# Altium project balenaFin_v1_x_x.PrjPcb (part 1 of 3)
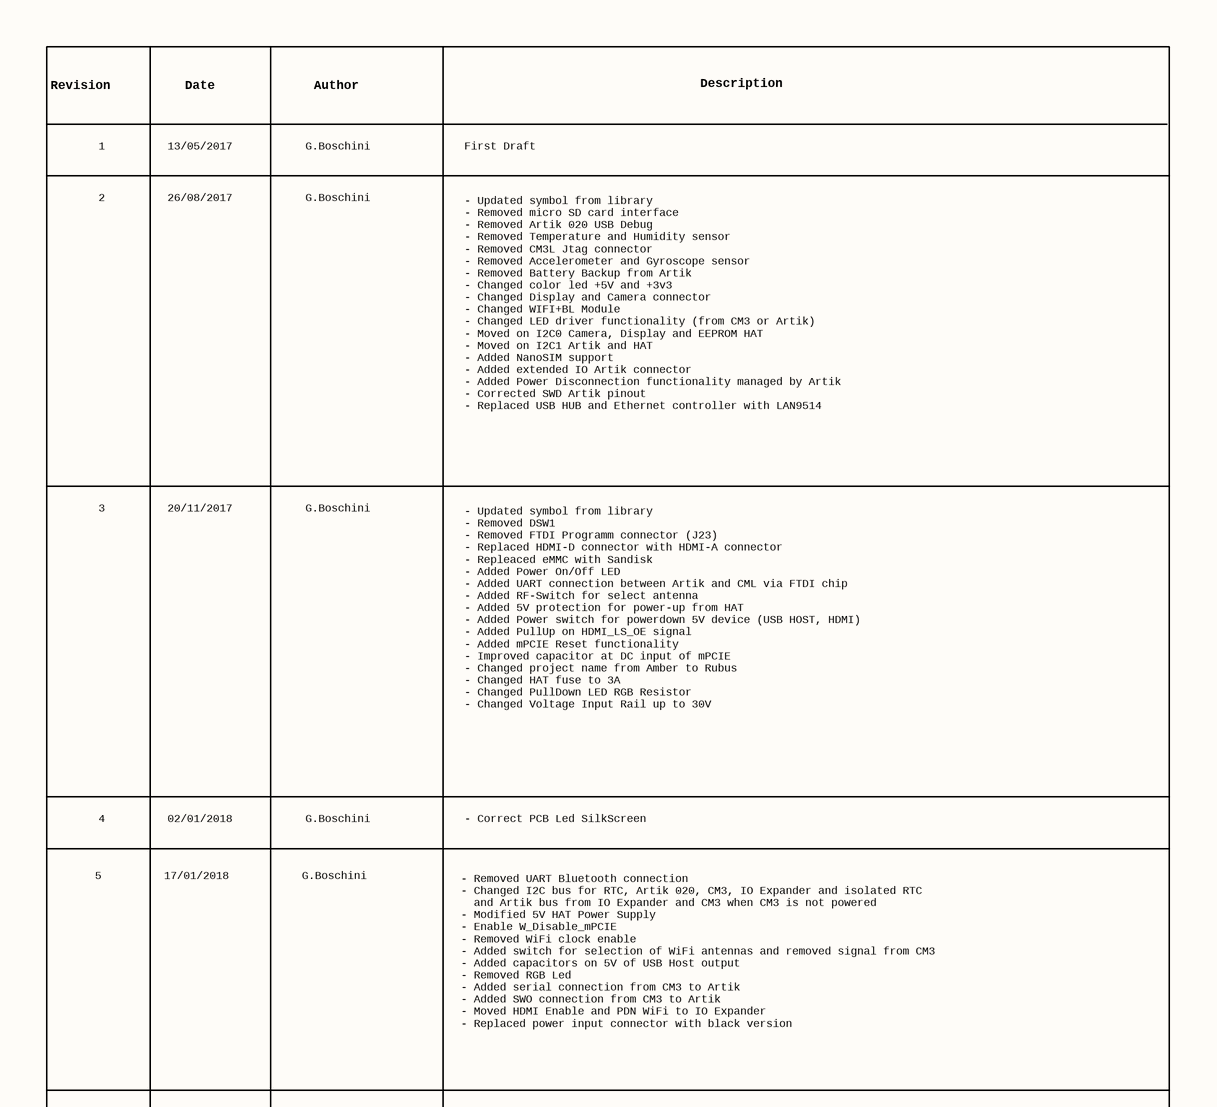
[diagram p0: 00 - REVISION.SchDoc, top left]
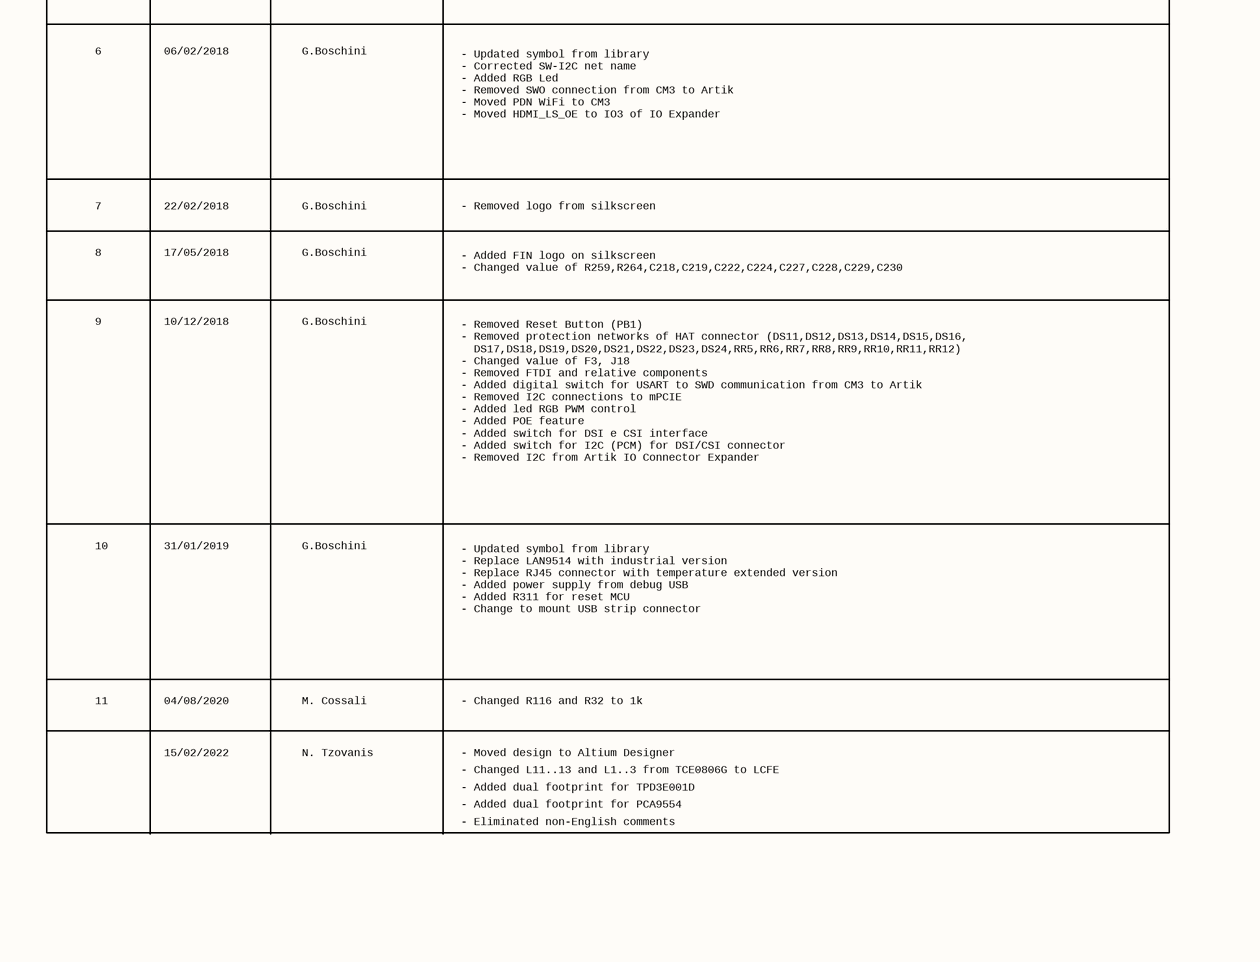
[diagram p1: 00 - REVISION.SchDoc, bottom left]
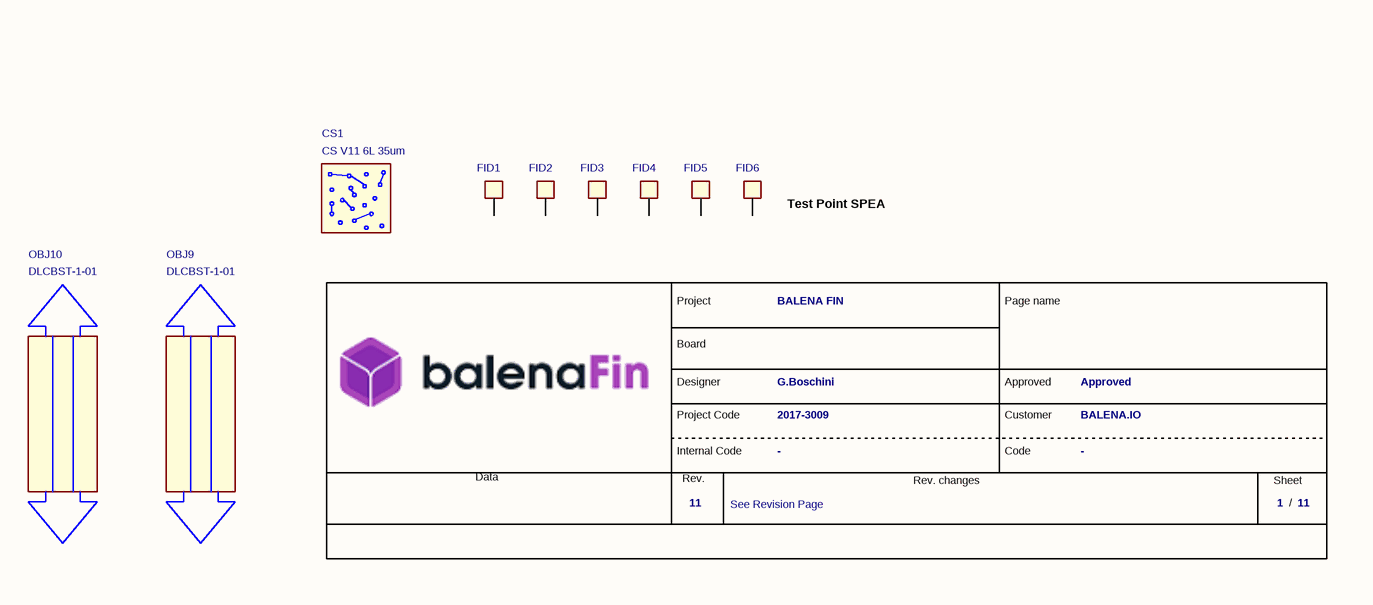
[diagram p2: 00 - REVISION.SchDoc, bottom right]
11 sheets, 518 parts. Net scope: global (net labels, ports and power ports of the same name join across sheets).
Board file: balenaFin_v1_x_x.PcbDoc
Sheets:
  00 - REVISION.SchDoc
  01 - CML3 CONNECTOR.SchDoc
  02 - POWER.SchDoc
  03 - WIFI - BLE.SchDoc
  04 - MIPI INTERFACE.SchDoc
  05 - USB.SchDoc
  06 - MCU.SchDoc
  07 - eMMC.SchDoc
  08 - HAT.SchDoc
  09 - mPCIE.SchDoc
  10 - ETHERNET.SchDoc

## Sheet 00 - REVISION.SchDoc
size 420 x 297 mm

### Parts
*?  Revision: 11  FAE RD code: 2017-3009  DocumentoRev: See Revision Page  Page Number: 1  Nome Progetto: BALENA FIN  Customer name: BALENA.IO  Project manager: Approved  Project designer: G.Boschini  (hidden comment: MyFAEVuoto)  (graphical)
CS1  CS V11 6L 35um  (graphical)
FID1  TPS  [FIDUCIAL]  (value not drawn)  (no BOM)
FID2  TPS  [FIDUCIAL]  (value not drawn)  (no BOM)
FID3  TPS  [FIDUCIAL]  (value not drawn)  (no BOM)
FID4  TPS  [FIDUCIAL]  (value not drawn)  (no BOM)
FID5  TPS  [FIDUCIAL]  (value not drawn)  (no BOM)
FID6  TPS  [FIDUCIAL]  (value not drawn)  (no BOM)
OBJ9  DLCBST-1-01  (mechanical)
OBJ10  DLCBST-1-01  (mechanical)

### Nets

Not connected (* = marked no-connect by the designer): FID1 1(TP); FID2 1(TP); FID3 1(TP); FID4 1(TP); FID5 1(TP); FID6 1(TP)

### Notes on the sheet
- Revision
- Date
- Author
- Description
- 1
- 2
- 13/05/2017
- 26/08/2017
- G.Boschini
- First Draft
- - Updated symbol from library
  - Removed micro SD card interface
  - Removed Artik 020 USB Debug
  - Removed Temperature and Humidity sensor
  - Removed CM3L Jtag connector
  - Removed Accelerometer and Gyroscope sensor
  - Removed Battery Backup from Artik
  - Changed color led +5V and +3v3
  - Changed Display and Camera connector
  - Changed WIFI+BL Module
  - Changed LED driver functionality (from CM3 or Artik)
  - Moved on I2C0 Camera, Display and EEPROM HAT
  - Moved on I2C1 Artik and HAT
  - Added NanoSIM support
  - Added extended IO Artik connector
  - Added Power Disconnection functionality managed by Artik
  - Corrected SWD Artik pinout
  - Replaced USB HUB and Ethernet controller with LAN9514
- 3
- 20/11/2017
- 4
- 02/01/2018
- - Updated symbol from library
  - Removed DSW1
  - Removed FTDI Programm connector (J23)
  - Replaced HDMI-D connector with HDMI-A connector
  - Repleaced eMMC with Sandisk
  - Added Power On/Off LED
  - Added UART connection between Artik and CML via FTDI chip
  - Added RF-Switch for select antenna
  - Added 5V protection for power-up from HAT
  - Added Power switch for powerdown 5V device (USB HOST, HDMI)
  - Added PullUp on HDMI_LS_OE signal
  - Added mPCIE Reset functionality
  - Improved capacitor at DC input of mPCIE
  - Changed project name from Amber to Rubus
  - Changed HAT fuse to 3A
  - Changed PullDown LED RGB Resistor
  - Changed Voltage Input Rail up to 30V
- - Correct PCB Led SilkScreen
- 5
- 17/01/2018
- - Removed UART Bluetooth connection
  - Changed I2C bus for RTC, Artik 020, CM3, IO Expander and isolated RTC
  and Artik bus from IO Expander and CM3 when CM3 is not powered
  - Modified 5V HAT Power Supply
  - Enable W_Disable_mPCIE
  - Removed WiFi clock enable
  - Added switch for selection of WiFi antennas and removed signal from CM3
  - Added capacitors on 5V of USB Host output
  - Removed RGB Led
  - Added serial connection from CM3 to Artik
  - Added SWO connection from CM3 to Artik
  - Moved HDMI Enable and PDN WiFi to IO Expander
  - Replaced power input connector with black version
- 6
- 06/02/2018
- - Updated symbol from library
  - Corrected SW-I2C net name
  - Added RGB Led
  - Removed SWO connection from CM3 to Artik
  - Moved PDN WiFi to CM3
  - Moved HDMI_LS_OE to IO3 of IO Expander
- 7
- 8
- 22/02/2018
- 17/05/2018
- - Removed logo from silkscreen
- - Added FIN logo on silkscreen
  - Changed value of R259,R264,C218,C219,C222,C224,C227,C228,C229,C230
- 9
- 10/12/2018
- - Removed Reset Button (PB1)
  - Removed protection networks of HAT connector (DS11,DS12,DS13,DS14,DS15,DS16,
  DS17,DS18,DS19,DS20,DS21,DS22,DS23,DS24,RR5,RR6,RR7,RR8,RR9,RR10,RR11,RR12)
  - Changed value of F3, J18
  - Removed FTDI and relative components
  - Added digital switch for USART to SWD communication from CM3 to Artik
  - Removed I2C connections to mPCIE
  - Added led RGB PWM control
  - Added POE feature
  - Added switch for DSI e CSI interface
  - Added switch for I2C (PCM) for DSI/CSI connector
  - Removed I2C from Artik IO Connector Expander
- 10
- 31/01/2019
- - Updated symbol from library
  - Replace LAN9514 with industrial version
  - Replace RJ45 connector with temperature extended version
  - Added power supply from debug USB
  - Added R311 for reset MCU
  - Change to mount USB strip connector
- (near FID6) Test Point SPEA
- 11
- 04/08/2020
- M. Cossali
- - Changed R116 and R32 to 1k
- 15/02/2022
- N. Tzovanis
- - Moved design to Altium Designer
- - Changed L11..13 and L1..3 from TCE0806G to LCFE
- - Added dual footprint for TPD3E001D
- - Added dual footprint for PCA9554
- - Eliminated non-English comments
- (in symbol MyFAEVuoto) Project; Page name; Board; Designer; Project Code; Customer; Internal Code; Code; Data; Rev.; Rev. changes; Sheet; /

### Library data of the parts
CS1 = PCB-CS: C.S. BALENAFIN V11 (90x90)mm ENIG 8L/SO(NERO)/SR sp=1.6mm Cu=35um; Famiglia: CIRCUITO STAMPATO; Caratteristiche: 20173009_BALENA-FIN_V11; Note: G.Boschini; Modello: BALENA; Price Distributor Cad: 0; Distributor: WE-ONLINE
FID1-FID6 = FIDUCIAL: MPN: Fiducial-No-BoM; Pkg Type: SMD; Mount: Yes
OBJ9 OBJ10 = SUPPORT PCB - DLCBST-1-01: Board Support Snap Lock / Snap Lock Nylon 0.063" (1.60mm) 1/16"; Note: Hole D=2.54mm; Pkg Type: THT; MPN: DLCBST-1-01; Mount: Yes
*? = MyFAEVuoto: Page Count: 11; Customer Code: -; Database: -

## Sheet 01 - CML3 CONNECTOR.SchDoc
size 420 x 297 mm
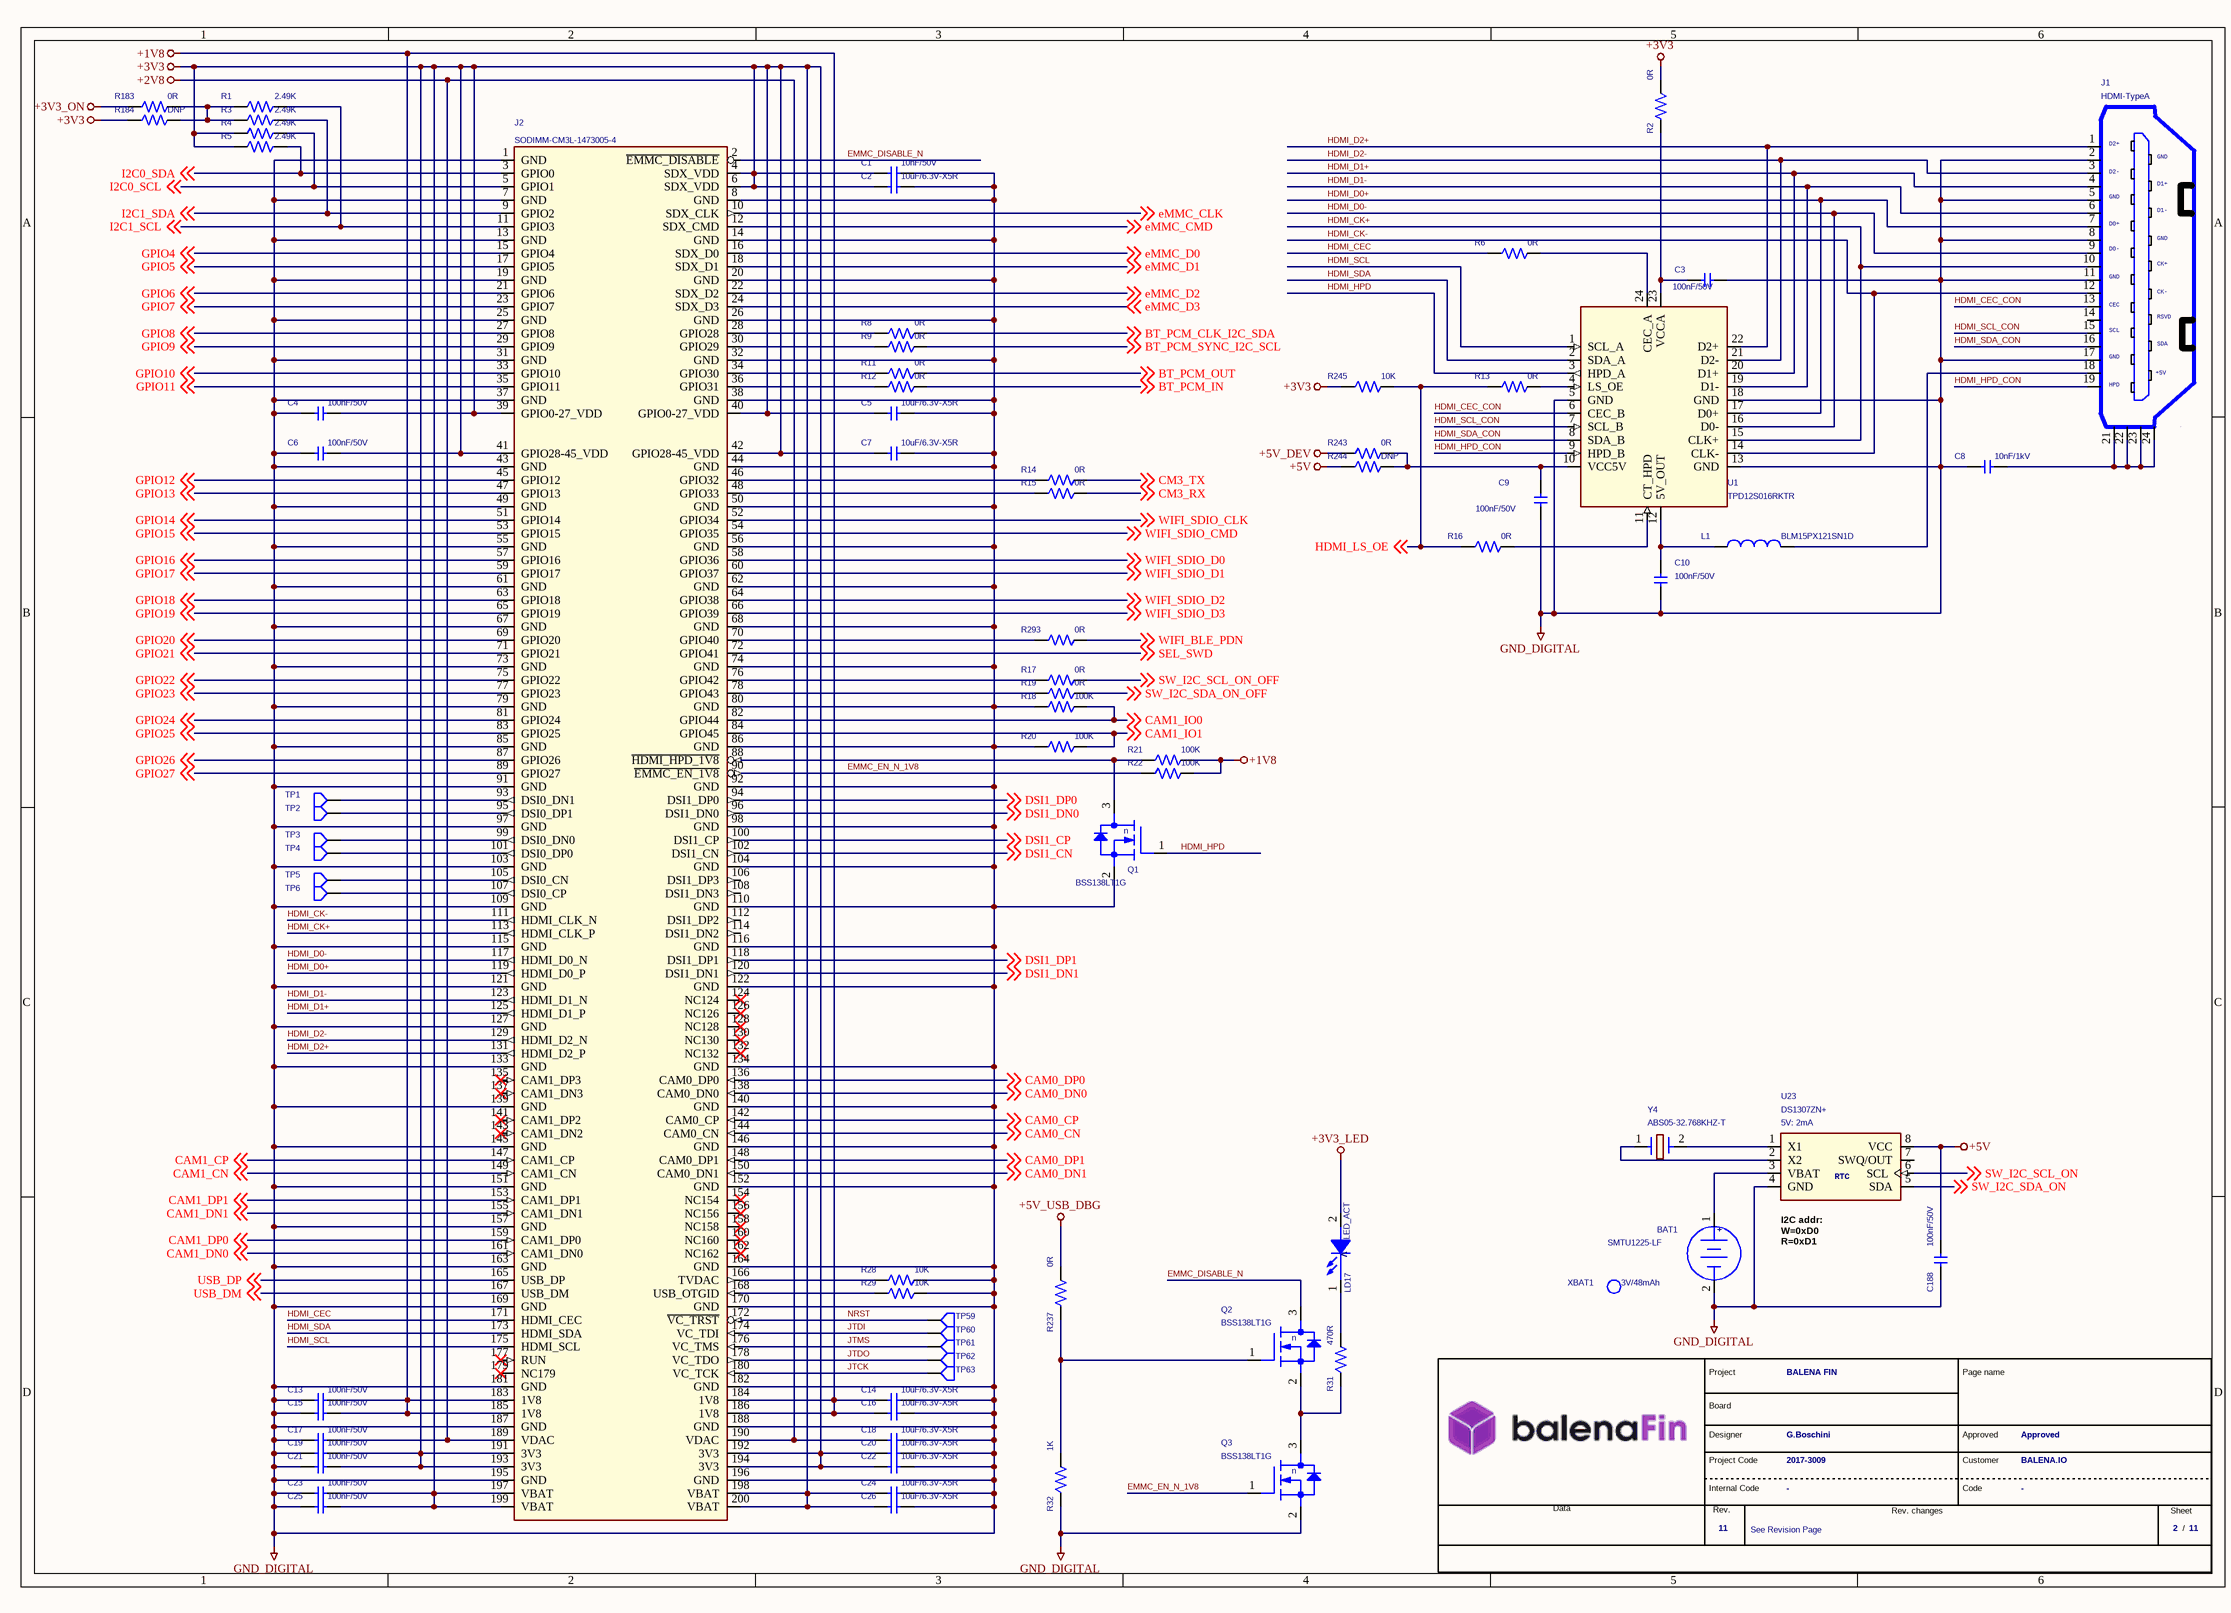
[diagram p3: 01 - CML3 CONNECTOR.SchDoc]

### Parts
(Parts that share a designator on the sheet are numbered #1, #2 ... from top to bottom, then left to right.)
*#1  Revision: 11  FAE RD code: 2017-3009  DocumentoRev: See Revision Page  Page Number: 2  Nome Progetto: BALENA FIN  Customer name: BALENA.IO  Project manager: Approved  Project designer: G.Boschini  (hidden comment: MyFAEVuoto)  (graphical)
BAT1  SMTU1225-LF  [BAT-SMTU1225]
C1  10nF/50V  [CS-C-0402]
C2  10uF/6.3V-X5R  [CS-C-0402]
C3  100nF/50V  [CS-C-0402]
C4  100nF/50V  [CS-C-0402]
C5  10uF/6.3V-X5R  [CS-C-0402]
C6  100nF/50V  [CS-C-0402]
C7  10uF/6.3V-X5R  [CS-C-0402]
C8  10nF/1kV  [CS-C-1206]
C9  100nF/50V  [CS-C-0402]
C10  100nF/50V  [CS-C-0402]
C13  100nF/50V  [CS-C-0402]
C14  10uF/6.3V-X5R  [CS-C-0402]
C15  100nF/50V  [CS-C-0402]
C16  10uF/6.3V-X5R  [CS-C-0402]
C17  100nF/50V  [CS-C-0402]
C18  10uF/6.3V-X5R  [CS-C-0402]
C19  100nF/50V  [CS-C-0402]
C20  10uF/6.3V-X5R  [CS-C-0402]
C21  100nF/50V  [CS-C-0402]
C22  10uF/6.3V-X5R  [CS-C-0402]
C23  100nF/50V  [CS-C-0402]
C24  10uF/6.3V-X5R  [CS-C-0402]
C25  100nF/50V  [CS-C-0402]
C26  10uF/6.3V-X5R  [CS-C-0402]
C188  100nF/50V  [CS-C-0402]
J1  HDMI-TypeA  [J-19-0050-FOS-HDMI-A-CNCTECH]
J2  SODIMM-CM3L-1473005-4  [J-200-0060-MOS-1473005-4]
L1  BLM15PX121SN1D  [LS-0402]
LD17  LED_ACT  [LD-0603]
Q1  BSS138LT1G  [SOT23]
Q2  BSS138LT1G  [SOT23]
Q3  BSS138LT1G  [SOT23]
R1  2.49K  [RS-0402]
R2  0R  [RS-0402]
R3  2.49K  [RS-0402]
R4  2.49K  [RS-0402]
R5  2.49K  [RS-0402]
R6  0R  [RS-0402]
R8  0R  [RS-0402]
R9  0R  [RS-0402]
R11  0R  [RS-0402]
R12  0R  [RS-0402]
R13  0R  [RS-0402]
R14  0R  [RS-0402]
R15  0R  [RS-0402]
R16  0R  [RS-0402]
R17  0R  [RS-0402]
R18  100K  [RS-0402]
R19  0R  [RS-0402]
R20  100K  [RS-0402]
R21  100K  [RS-0402]
R22  100K  [RS-0402]
R28  10K  [RS-0402]
R29  10K  [RS-0402]
R31  470R  [RS-0402]
R32  1K  [RS-0402]
R183  0R  [RS-0402]
R184  DNP  [RS-0402]
R237  0R  [RS-0402]
R243  0R  [RS-0402]
R244  DNP  [RS-0402]
R245  10K  [RS-0402]
R293  0R  [RS-0402]
TP1  TPS  [TPS-0100]  (value not drawn)  (no BOM)
TP2  TPS  [TPS-0100]  (value not drawn)  (no BOM)
TP3  TPS  [TPS-0100]  (value not drawn)  (no BOM)
TP4  TPS  [TPS-0100]  (value not drawn)  (no BOM)
TP5  TPS  [TPS-0100]  (value not drawn)  (no BOM)
TP6  TPS  [TPS-0100]  (value not drawn)  (no BOM)
TP59  TPS  [TPS-0100]  (value not drawn)  (no BOM)
TP60  TPS  [TPS-0100]  (value not drawn)  (no BOM)
TP61  TPS  [TPS-0100]  (value not drawn)  (no BOM)
TP62  TPS  [TPS-0100]  (value not drawn)  (no BOM)
TP63  TPS  [TPS-0100]  (value not drawn)  (no BOM)
U1  TPD12S016RKTR  [UFQFN24-4X2]
U23  DS1307ZN+  Power requirements: 5V: 2mA  [SOIC8]
XBAT1  3V/48mAh  (mechanical)
Y4  ABS05-32.768KHZ-T  [Y-ABS05]

### Nets
+1V8: C13.2 C14.1 C15.2 C16.1 J2.183(1V8) J2.184(1V8) J2.185(1V8) J2.186(1V8) R21.2 R22.2
+2V8: C17.2 C18.1 J2.189(VDAC) J2.190(VDAC)
+3V3: C1.1 C2.1 C4.2 C5.1 C6.2 C7.1 C19.2 C20.1 C21.2 C22.1 C23.2 C24.1 C25.2 C26.1 J2.4(SDX_VDD) J2.6(SDX_VDD) J2.39(GPIO0-27_VDD) J2.40(GPIO0-27_VDD) J2.41(GPIO28-45_VDD) J2.42(GPIO28-45_VDD) J2.191(3V3) J2.192(3V3) J2.193(3V3) J2.194(3V3) J2.197(VBAT) J2.198(VBAT) J2.199(VBAT) J2.200(VBAT) R2.2 R4.2 R5.2 R184.1 R245.1
+3V3_LED: LD17.2(A)
+3V3_ON: R183.1
+5V: C188.1 R244.1 U23.8(VCC)
+5V_DEV: R243.1
+5V_USB_DBG: R237.2
GND_DIGITAL: BAT1.2(-) C1.2 C2.2 C3.2 C4.1 C5.2 C6.1 C7.2 C8.1 C9.2 C10.2 C13.1 C14.2 C15.1 C16.2 C17.1 C18.2 C19.1 C20.2 C21.1 C22.2 C23.1 C24.2 C25.1 C26.2 C188.2 J1.2(GND_2) J1.5(GND_5) J1.8(GND_8) J1.11(GND_11) J1.17(GND_17) J2.1(GND) J2.7(GND) J2.8(GND) J2.13(GND) J2.14(GND) J2.19(GND) J2.20(GND) J2.25(GND) J2.26(GND) J2.31(GND) J2.32(GND) J2.37(GND) J2.38(GND) J2.43(GND) J2.44(GND) J2.49(GND) J2.50(GND) J2.55(GND) J2.56(GND) J2.61(GND) J2.62(GND) J2.67(GND) J2.68(GND) J2.73(GND) J2.74(GND) J2.79(GND) J2.80(GND) J2.85(GND) J2.86(GND) J2.91(GND) J2.92(GND) J2.97(GND) J2.98(GND) J2.103(GND) J2.104(GND) J2.109(GND) J2.110(GND) J2.115(GND) J2.116(GND) J2.121(GND) J2.122(GND) J2.127(GND) J2.133(GND) J2.134(GND) J2.139(GND) J2.140(GND) J2.145(GND) J2.146(GND) J2.151(GND) J2.152(GND) J2.157(GND) J2.163(GND) J2.164(GND) J2.169(GND) J2.170(GND) J2.181(GND) J2.182(GND) J2.187(GND) J2.188(GND) J2.195(GND) J2.196(GND) Q1.2(S) Q3.2(S) R18.1 R20.1 R28.2 R29.2 R32.1 U1.5(GND) U1.13(GND) U1.18(GND) U23.4(GND)
BT_PCM_CLK_I2C_SDA: R8.2 ; off-sheet BT_PCM_CLK_I2C_SDA
BT_PCM_IN: R12.2 ; off-sheet BT_PCM_IN
BT_PCM_OUT: R11.2 ; off-sheet BT_PCM_OUT
BT_PCM_SYNC_I2C_SCL: R9.2 ; off-sheet BT_PCM_SYNC_I2C_SCL
CAM0_CN: J2.144(CAM0_CN) ; off-sheet CAM0_CN
CAM0_CP: J2.142(CAM0_CP) ; off-sheet CAM0_CP
CAM0_DN0: J2.138(CAM0_DN0) ; off-sheet CAM0_DN0
CAM0_DN1: J2.150(CAM0_DN1) ; off-sheet CAM0_DN1
CAM0_DP0: J2.136(CAM0_DP0) ; off-sheet CAM0_DP0
CAM0_DP1: J2.148(CAM0_DP1) ; off-sheet CAM0_DP1
CAM1_CN: J2.149(CAM1_CN) ; off-sheet CAM1_CN
CAM1_CP: J2.147(CAM1_CP) ; off-sheet CAM1_CP
CAM1_DN0: J2.161(CAM1_DN0) ; off-sheet CAM1_DN0
CAM1_DN1: J2.155(CAM1_DN1) ; off-sheet CAM1_DN1
CAM1_DP0: J2.159(CAM1_DP0) ; off-sheet CAM1_DP0
CAM1_DP1: J2.153(CAM1_DP1) ; off-sheet CAM1_DP1
CAM1_IO0: J2.82(GPIO44) R18.2 ; off-sheet CAM1_IO0
CAM1_IO1: J2.84(GPIO45) R20.2 ; off-sheet CAM1_IO1
CM3_RX: R15.2 ; off-sheet CM3_RX
CM3_TX: R14.2 ; off-sheet CM3_TX
DSI1_CN: J2.102(DSI1_CN) ; off-sheet DSI1_CN
DSI1_CP: J2.100(DSI1_CP) ; off-sheet DSI1_CP
DSI1_DN0: J2.96(DSI1_DN0) ; off-sheet DSI1_DN0
DSI1_DN1: J2.120(DSI1_DN1) ; off-sheet DSI1_DN1
DSI1_DP0: J2.94(DSI1_DP0) ; off-sheet DSI1_DP0
DSI1_DP1: J2.118(DSI1_DP1) ; off-sheet DSI1_DP1
eMMC_CLK: J2.10(SDX_CLK) ; off-sheet eMMC_CLK
eMMC_CMD: J2.12(SDX_CMD) ; off-sheet eMMC_CMD
eMMC_D0: J2.16(SDX_D0) ; off-sheet eMMC_D0
eMMC_D1: J2.18(SDX_D1) ; off-sheet eMMC_D1
eMMC_D2: J2.22(SDX_D2) ; off-sheet eMMC_D2
eMMC_D3: J2.24(SDX_D3) ; off-sheet eMMC_D3
EMMC_DISABLE_N: J2.2(~{EMMC_DISABLE}) Q2.3(D)
EMMC_EN_N_1V8: J2.90(~{EMMC_EN_1V8}) Q3.1(G) R22.1
GPIO4: J2.15(GPIO4) ; off-sheet GPIO4
GPIO5: J2.17(GPIO5) ; off-sheet GPIO5
GPIO6: J2.21(GPIO6) ; off-sheet GPIO6
GPIO7: J2.23(GPIO7) ; off-sheet GPIO7
GPIO8: J2.27(GPIO8) ; off-sheet GPIO8
GPIO9: J2.29(GPIO9) ; off-sheet GPIO9
GPIO10: J2.33(GPIO10) ; off-sheet GPIO10
GPIO11: J2.35(GPIO11) ; off-sheet GPIO11
GPIO12: J2.45(GPIO12) ; off-sheet GPIO12
GPIO13: J2.47(GPIO13) ; off-sheet GPIO13
GPIO14: J2.51(GPIO14) ; off-sheet GPIO14
GPIO15: J2.53(GPIO15) ; off-sheet GPIO15
GPIO16: J2.57(GPIO16) ; off-sheet GPIO16
GPIO17: J2.59(GPIO17) ; off-sheet GPIO17
GPIO18: J2.63(GPIO18) ; off-sheet GPIO18
GPIO19: J2.65(GPIO19) ; off-sheet GPIO19
GPIO20: J2.69(GPIO20) ; off-sheet GPIO20
GPIO21: J2.71(GPIO21) ; off-sheet GPIO21
GPIO22: J2.75(GPIO22) ; off-sheet GPIO22
GPIO23: J2.77(GPIO23) ; off-sheet GPIO23
GPIO24: J2.81(GPIO24) ; off-sheet GPIO24
GPIO25: J2.83(GPIO25) ; off-sheet GPIO25
GPIO26: J2.87(GPIO26) ; off-sheet GPIO26
GPIO27: J2.89(GPIO27) ; off-sheet GPIO27
HDMI_CEC: J2.171(HDMI_CEC) R6.1
HDMI_CEC_CON: J1.13(CEC) U1.6(CEC_B)
HDMI_CK+: J1.10(CK+) J2.113(HDMI_CLK_P) U1.15(CLK+)
HDMI_CK-: J1.12(CK-) J2.111(HDMI_CLK_N) U1.14(CLK-)
HDMI_D0+: J1.7(D0+) J2.119(HDMI_D0_P) U1.17(D0+)
HDMI_D0-: J1.9(D0-) J2.117(HDMI_D0_N) U1.16(D0-)
HDMI_D1+: J1.4(D1+) J2.125(HDMI_D1_P) U1.20(D1+)
HDMI_D1-: J1.6(D1-) J2.123(HDMI_D1_N) U1.19(D1-)
HDMI_D2+: J1.1(D2+) J2.131(HDMI_D2_P) U1.22(D2+)
HDMI_D2-: J1.3(D2-) J2.129(HDMI_D2_N) U1.21(D2-)
HDMI_HPD: Q1.1(G) U1.3(HPD_A)
HDMI_HPD_CON: J1.19(HDP) U1.9(HPD_B)
HDMI_LS_OE: R13.1 R16.1 R245.2 ; off-sheet HDMI_LS_OE
HDMI_SCL: J2.175(HDMI_SCL) U1.1(SCL_A)
HDMI_SCL_CON: J1.15(SCL) U1.7(SCL_B)
HDMI_SDA: J2.173(HDMI_SDA) U1.2(SDA_A)
HDMI_SDA_CON: J1.16(SDA) U1.8(SDA_B)
I2C0_SCL: J2.5(GPIO1) R4.1 ; off-sheet I2C0_SCL
I2C0_SDA: J2.3(GPIO0) R5.1 ; off-sheet I2C0_SDA
I2C1_SCL: J2.11(GPIO3) R1.1 ; off-sheet I2C1_SCL
I2C1_SDA: J2.9(GPIO2) R3.1 ; off-sheet I2C1_SDA
JTCK: J2.180(VC_TCK) TP63.1(TP)
JTDI: J2.174(VC_TDI) TP60.1(TP)
JTDO: J2.178(VC_TDO) TP62.1(TP)
JTMS: J2.176(VC_TMS) TP61.1(TP)
NRST: J2.172(~{VC_TRST}) TP59.1(TP)
SEL_SWD: J2.72(GPIO41) ; off-sheet SEL_SWD
SW_I2C_SCL_ON: U23.6(SCL) ; off-sheet SW_I2C_SCL_ON
SW_I2C_SCL_ON_OFF: R17.2 ; off-sheet SW_I2C_SCL_ON_OFF
SW_I2C_SDA_ON: U23.5(SDA) ; off-sheet SW_I2C_SDA_ON
SW_I2C_SDA_ON_OFF: R19.2 ; off-sheet SW_I2C_SDA_ON_OFF
USB_DM: J2.167(USB_DM) ; off-sheet USB_DM
USB_DP: J2.165(USB_DP) ; off-sheet USB_DP
WIFI_BLE_PDN: R293.2 ; off-sheet WIFI_BLE_PDN
WIFI_SDIO_CLK: J2.52(GPIO34) ; off-sheet WIFI_SDIO_CLK
WIFI_SDIO_CMD: J2.54(GPIO35) ; off-sheet WIFI_SDIO_CMD
WIFI_SDIO_D0: J2.58(GPIO36) ; off-sheet WIFI_SDIO_D0
WIFI_SDIO_D1: J2.60(GPIO37) ; off-sheet WIFI_SDIO_D1
WIFI_SDIO_D2: J2.64(GPIO38) ; off-sheet WIFI_SDIO_D2
WIFI_SDIO_D3: J2.66(GPIO39) ; off-sheet WIFI_SDIO_D3
NetBAT1_1: BAT1.1(+) U23.3(VBAT)
NetC3_1: C3.1 R2.1 U1.23(VCCA)
NetC8_2: C8.2 J1.21(GND_21) J1.22(GND_22) J1.23(GND_23) J1.24(GND_24)
NetC9_1: C9.1 R243.2 R244.2 U1.10(VCC5V)
NetC10_1: C10.1 L1.1 U1.12(5V_OUT)
NetJ1_18: J1.18(+5V) L1.2
NetJ2_28: J2.28(GPIO28) R8.1
NetJ2_30: J2.30(GPIO29) R9.1
NetJ2_34: J2.34(GPIO30) R11.1
NetJ2_36: J2.36(GPIO31) R12.1
NetJ2_46: J2.46(GPIO32) R14.1
NetJ2_48: J2.48(GPIO33) R15.1
NetJ2_70: J2.70(GPIO40) R293.1
NetJ2_76: J2.76(GPIO42) R17.1
NetJ2_78: J2.78(GPIO43) R19.1
NetJ2_88: J2.88(~{HDMI_HPD_1V8}) Q1.3(D) R21.1
NetJ2_93: J2.93(DSI0_DN1) TP1.1(TP)
NetJ2_95: J2.95(DSI0_DP1) TP2.1(TP)
NetJ2_99: J2.99(DSI0_DN0) TP3.1(TP)
NetJ2_101: J2.101(DSI0_DP0) TP4.1(TP)
NetJ2_105: J2.105(DSI0_CN) TP5.1(TP)
NetJ2_107: J2.107(DSI0_CP) TP6.1(TP)
NetJ2_166: J2.166(TVDAC) R28.1
NetJ2_168: J2.168(USB_OTGID) R29.1
NetLD17_1: LD17.1(C) R31.2
NetQ2_1: Q2.1(G) R32.2 R237.1
NetQ2_2: Q2.2(S) Q3.3(D) R31.1
NetR1_2: R1.2 R3.2 R183.2 R184.2
NetR6_2: R6.2 U1.24(CEC_A)
NetR13_2: R13.2 U1.4(LS_OE)
NetR16_2: R16.2 U1.11(CT_HPD)
NetU23_1: U23.1(X1) Y4.2
NetU23_2: U23.2(X2) Y4.1

Not connected (* = marked no-connect by the designer): J1 14(RES); J2 106(DSI1_DP3) 108(DSI1_DN3) 112(DSI1_DP2) 114(DSI1_DN2) 124(NC124)* 126(NC126)* 128(NC128)* 130(NC130)* 132(NC132)* 135(CAM1_DP3)* 137(CAM1_DN3)* 141(CAM1_DP2)* 143(CAM1_DN2)* 154(NC154)* 156(NC156)* 158(NC158)* 160(NC160)* 162(NC162)* 177(RUN)* 179(NC179)*; U23 7(SWQ/OUT)

### Notes on the sheet
- (near U23) I2C addr:
  W=0xD0
  R=0xD1
- (in symbol HDMI - J-19-0050-FOS-HDMI-A-CNC) GND; RSVD; HPD
- (in symbol LED V - GENERICO - 0603) V
- (in symbol MyFAEVuoto) Project; Page name; Board; Designer; Project Code; Customer; Internal Code; Code; Data; Rev.; Rev. changes; Sheet; /
- (in symbol NMOS - BSS138 - 0.2A/50V) n

### Library data of the parts
BAT1 = PORTA BATTERIA - SMTU1225-LF: Coin Cell Battery Holders SFC - MNT FOR CR1225; Room: RTC; Pkg Type: SMD; Temperature range: -40°..+100°; MPN: SMTU1225-LF; Mount: Yes
C1 = CS-C-0402-10n/50V: CHIP CAP.CER. 10nF 50V 10% X7R 0402; MPN: Generic; Alternative MPN: C0402C103K5RACTU; Room: CM3L; Pkg Type: SMD; Mount: Yes
C2 C5 C7 C14 C16 C18 C20 C22 C24 C26 = CS-C-0402-10u/6V3-X5R: CHIP CAP.CER. 10uF 6.3V 20% X5R 0402; MPN: Generic; Alternative MPN: CC0402MRX5R5BB106; Pkg Type: SMD; Room: CM3L; Temperature range: -55°..+85°; Mount: Yes
C3 C9 C10 = CS-C-0402-100n/16V: CHIP CAP.CER. 100nF 16V 10% X7R 0402; MPN: Generic; Alternative MPN: C0402C104K4RACTU; Room: HDMI; Pkg Type: SMD; Mount: Yes
C4 C6 C13 C15 C17 C19 C21 C23 C25 = CS-C-0402-100n/16V: CHIP CAP.CER. 100nF 16V 10% X7R 0402; MPN: Generic; Alternative MPN: C0402C104K4RACTU; Room: CM3L; Pkg Type: SMD; Mount: Yes
C8 = CS-C-1206-10n/1kV: CHIP CAP.CER. 10nF 1000V 10% X7R 1206; MPN: Generic; Alternative MPN: GRM31CR73A103KW03L; Room: HDMI; Pkg Type: SMD; Mount: Yes
C188 = CS-C-0402-100n/16V: CHIP CAP.CER. 100nF 16V 10% X7R 0402; MPN: Generic; Alternative MPN: C0402C104K4RACTU; Room: RTC; Pkg Type: SMD; Mount: Yes
J1 = HDMI - J-19-0050-FOS-HDMI-A-CNC: HDMI Receptacle Connector - 19 Position Surface Mount, Right Angle; MPN: 2000-1-2-41-00-BK; Note: Full SMD; Pkg Type: SMD; Room: HDMI; Temperature range: -20°..+85°; Mount: Yes
J2 = SODIMM - CM3L - 1473005-4: 200 Position SODIMM DDR2 - SDRAM Socket Surface Mount, Right Angle; Power requirements: VBAT: 3.5W - 3V3: 250mA - 1V8: 250mA - VDAC:25mA - GPIO0-27-VDD: 50mA- GPIO28-45-VDD: 50mA - SDVDD:50mA; Pkg Type: SMD; Room: CM3L; Temperature range: -55°..+85°; MPN: 1473005-4; Mount: Yes
L1 = FIL-BLM15PX121SN1D- 120R/2A: FERRITE 120R 2A 25% 0402 BLM15PX121SN1D MURATA SMT; Room: HDMI; Pkg Type: SMD; Temperature range: -55°..+125°; MPN: BLM15PX121SN1D; Mount: Yes
LD17 = LED V - GENERICO - 0603: LED Green 0603 SMT; Alternative MPN: KP-1608SGC; Pkg Type: SMD; Note: V=2.2V/20mA; Room: CM3L; MPN: Generic; Mount: Yes
Q1 = NMOS - BSS138 - 0.2A/50V: MOSFET N-CH 50V 220MA SOT23-3; Room: HDMI; Pkg Type: SMD; MPN: BSS138LT1G; Mount: Yes
Q2 Q3 = NMOS - BSS138 - 0.2A/50V: MOSFET N-CH 50V 220MA SOT23-3; Room: CM3L; Pkg Type: SMD; MPN: BSS138LT1G; Mount: Yes
R1 R3-R5 = RS-0402-2.49k: CHIP RES. 2K49 0402 1/16W 1% 100PPM/°C; MPN: Generic; Room: CM3L; Note: 100ppm; Pkg Type: SMD; Mount: Yes
R2 R6 R8 R9 R11-R17 R19 R183 R237 R243 R293 = RS-0402-0r: CHIP RES. 0R 0402 1/16W 1%; MPN: Generic; Room: CM3L; Pkg Type: SMD; Mount: Yes
R18 R20 = RS-0402-100k: CHIP RES. 100K 0402 1/16W 1%; MPN: Generic; Pkg Type: SMD; Room: CM3L; Mount: Yes
R21 R22 = RS-0402-100k: CHIP RES. 100K 0402 1/16W 1%; MPN: Generic; Pkg Type: SMD; Room: HDMI; Mount: Yes
R28 R29 = RS-0402-10k: CHIP RES. 10K 0402 1/16W 1%; MPN: Generic; Room: CM3L; Pkg Type: SMD; Temperature range: -55°..+125°; Mount: Yes
R31 = RS-0402-470r: CHIP RES. 470R 0402 1/16W 1%; MPN: Generic; Pkg Type: SMD; Room: CM3L; Mount: Yes
R32 = RS-0402-1k: CHIP RES. 1K 0402 1/16W 1%; MPN: Generic; Pkg Type: SMD; Room: POWER LED; Mount: Yes
R184 = RS-0402: CHIP RES. 0R 0402 1/10W 1%; MPN: Generic; Pkg Type: SMD; Room: HUB-USB; Mount: No
R244 = RS-0402: CHIP RES. 0402; MPN: Generic; Pkg Type: SMD; Mount: No
R245 = RS-0402-10k: CHIP RES. 10K 0402 1/16W 1%; MPN: Generic; Room: HDMI; Pkg Type: SMD; Temperature range: -55°..+125°; Mount: Yes
TP1-TP6 TP59-TP63 = TEST POINT SMD 1 MM: TEST POINT SMD; MPN: TP-No-BoM; Pkg Type: SMD; Mount: Yes
U1 = HDMI-TPD12S016RKTR-ESD PROTECT: HDMI, I²C Buffer, ESD Protection Interface 24-UQFN (4x2); Power requirements: 5V: 100mA - 3V:50uA; Pkg Type: SMD; Room: HDMI; Temperature range: -40° - +85°; MPN: TPD12S016RKTR; Mount: Yes
U23 = RTC - DS1307ZN+: IC RTC CLK/CALENDAR I2C 8-SOIC; Pkg Type: SMD; Room: RTC; Temperature range: -40°..+85°; MPN: DS1307ZN+; Mount: Yes
XBAT1 = LITIO - CR1225 - 48mAh/3V: LITHUM BATTERY 3V 48mAh (-30 / +70°C) CR1225; MPN: CR1225FV-LF; Pkg Type: THT; Room: RTC; Temperature range: -30°..+70°; Mount: Yes
Y4 = QUARZO-ABS05-32.768KHZ-T: 32.768kHz ±20ppm Crystal 12.5pF 90 kOhms 2-SMD, No  Lead D=1.6x1; Room: RTC; Note: CL=12.5p; Pkg Type: SMD; Temperature range: -40°..+85°; MPN: ABS05-32.768KHZ-T; Mount: Yes
*#1 = MyFAEVuoto: Page Count: 11; Customer Code: -; Database: -

## Sheet 02 - POWER.SchDoc
size 420 x 297 mm
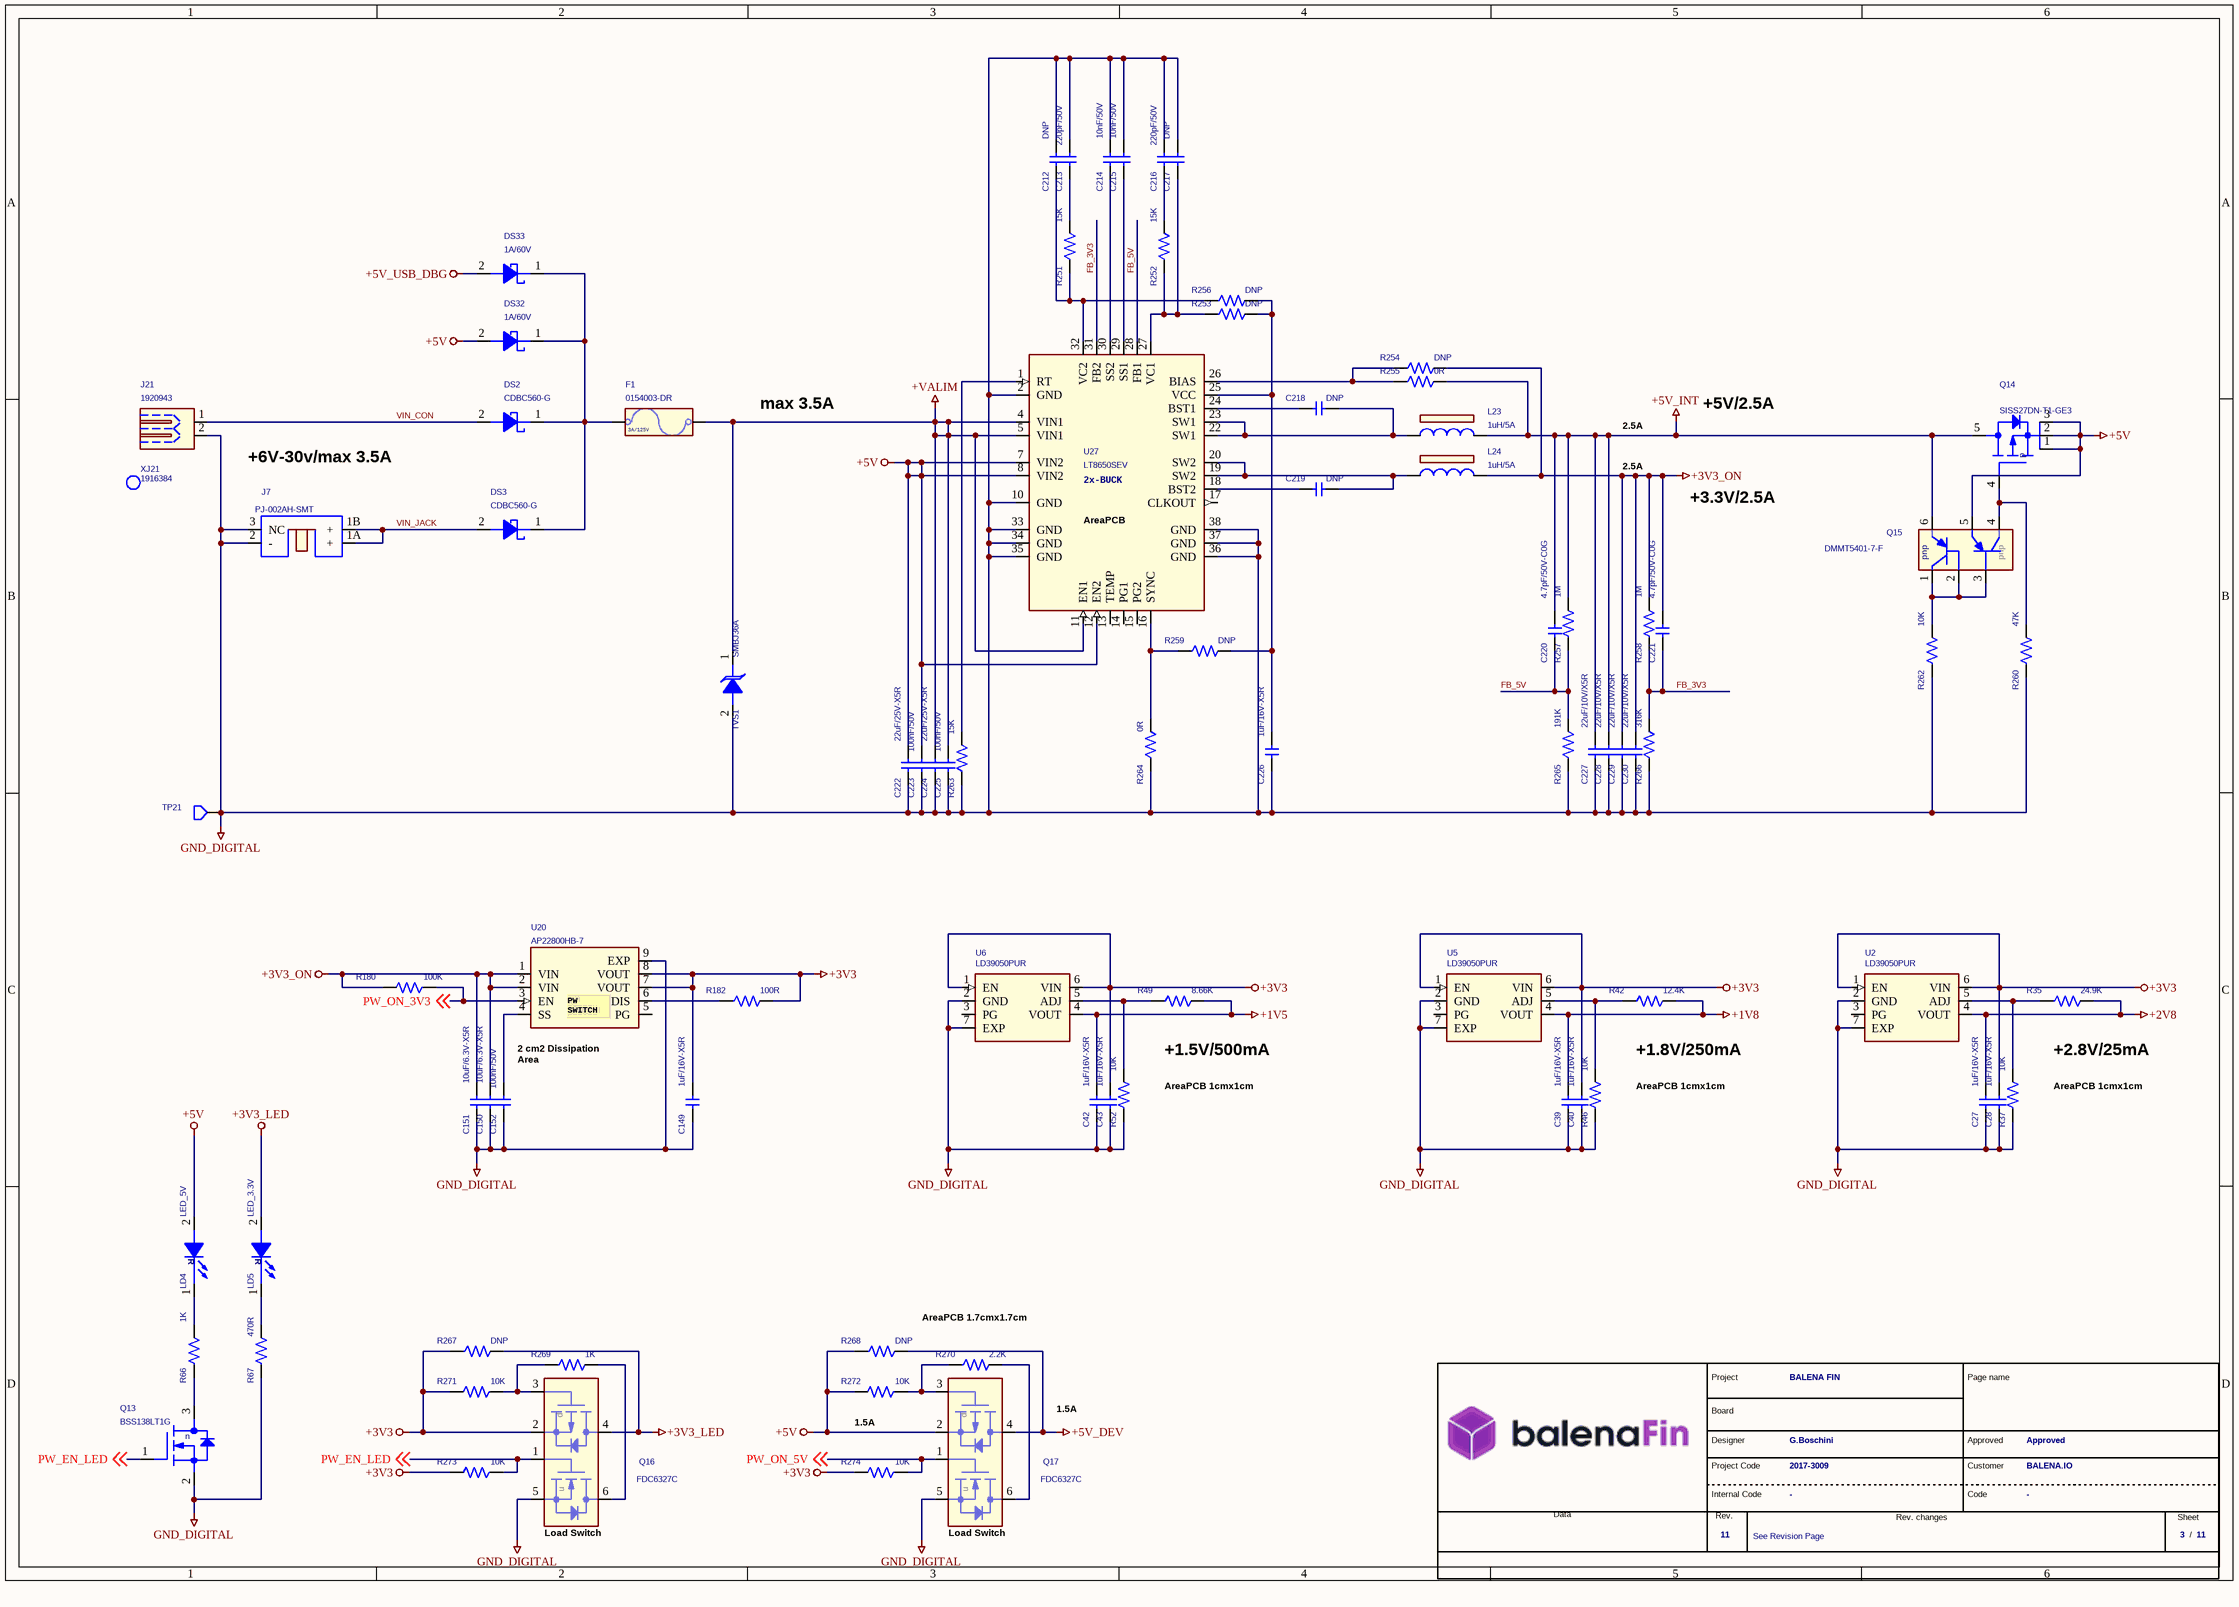
[diagram p4: 02 - POWER.SchDoc]

### Parts
(Parts that share a designator on the sheet are numbered #1, #2 ... from top to bottom, then left to right.)
*#2  Revision: 11  FAE RD code: 2017-3009  DocumentoRev: See Revision Page  Page Number: 3  Nome Progetto: BALENA FIN  Customer name: BALENA.IO  Project manager: Approved  Project designer: G.Boschini  (hidden comment: MyFAEVuoto)  (graphical)
C27  1uF/16V-X5R  [CS-C-0402]
C28  1uF/16V-X5R  [CS-C-0402]
C39  1uF/16V-X5R  [CS-C-0402]
C40  1uF/16V-X5R  [CS-C-0402]
C42  1uF/16V-X5R  [CS-C-0402]
C43  1uF/16V-X5R  [CS-C-0402]
C149  1uF/16V-X5R  [CS-C-0402]
C150  10uF/6.3V-X5R  [CS-C-0402]
C151  10uF/6.3V-X5R  [CS-C-0402]
C152  100nF/50V  [CS-C-0402]
C212  DNP  [CS-C-0402]
C213  220pF/50V  [CS-C-0402]
C214  10nF/50V  [CS-C-0402]
C215  10nF/50V  [CS-C-0402]
C216  220pF/50V  [CS-C-0402]
C217  DNP  [CS-C-0402]
C218  DNP  [CS-C-0402]
C219  DNP  [CS-C-0402]
C220  4.7pF/50V-C0G  [CS-C-0402]
C221  4.7pF/50V-C0G  [CS-C-0402]
C222  22uF/25V-X5R  [CS-C-1206]
C223  100nF/50V  [CS-C-0603]
C224  22uF/25V-X5R  [CS-C-1206]
C225  100nF/50V  [CS-C-0603]
C226  1uF/16V-X5R  [CS-C-0402]
C227  22uF/10V/X5R  [CS-C-0603]
C228  22uF/10V/X5R  [CS-C-0603]
C229  22uF/10V/X5R  [CS-C-0603]
C230  22uF/10V/X5R  [CS-C-0603]
DS2  CDBC560-G  [SMC]
DS3  CDBC560-G  [SMC]
DS32  1A/60V  [SMA]
DS33  1A/60V  [SMA]
F1  0154003-DR  [F-LT154]
J7  PJ-002AH-SMT  [J-CUPJ002AH]
J21  1920943  [J-2-0350-MOT-MC]
L23  1uH/5A  [LS-VIIHLP1212BZ11]
L24  1uH/5A  [LS-VIIHLP1212BZ11]
LD4  LED_5V  [LD-0603]
LD5  LED_3.3V  [LD-0603]
Q13  BSS138LT1G  [SOT23]
Q14  SISS27DN-T1-GE3  [POWERVDFN8-0330X0330]
Q15  DMMT5401-7-F  [SOT23-6L]
Q16  FDC6327C  [SOT23-6-DBV]
Q17  FDC6327C  [SOT23-6-DBV]
R35  24.9K  [RS-0402]
R37  10K  [RS-0402]
R42  12.4K  [RS-0402]
R46  10K  [RS-0402]
R49  8.66K  [RS-0402]
R52  10K  [RS-0402]
R66  1K  [RS-0402]
R67  470R  [RS-0402]
R180  100K  [RS-0402]
R182  100R  [RS-1206]
R251  15K  [RS-0402]
R252  15K  [RS-0402]
R253  DNP  [RS-0402]
R254  DNP  [RS-0402]
R255  0R  [RS-0402]
R256  DNP  [RS-0402]
R257  1M  [RS-0402]
R258  1M  [RS-0402]
R259  DNP  [RS-0402]
R260  47K  [RS-0402]
R262  10K  [RS-0402]
R263  15K  [RS-0402]
R264  0R  [RS-0402]
R265  191K  [RS-0402]
R266  316K  [RS-0402]
R267  DNP  [RS-0603]
R268  DNP  [RS-0603]
R269  1K  [RS-0402]
R270  2.2K  [RS-0402]
R271  10K  [RS-0402]
R272  10K  [RS-0402]
R273  10K  [RS-0402]
R274  10K  [RS-0402]
TP21  TPT  [TPT-0100]  (value not drawn)
TVS1  SMBJ36A  [SMB]
U2  LD39050PUR  [DFN6_3X3_STM-L]
U5  LD39050PUR  [DFN6_3X3_STM-L]
U6  LD39050PUR  [DFN6_3X3_STM-L]
U20  AP22800HB-7  [UFDFN8-EXP-0210X0160]
U27  LT8650SEV  [IC-LT8650SEV]
XJ21  1916384  (mechanical)

### Nets
+1V5: C42.1 R49.2 U6.4(VOUT)
+1V8: C39.1 R42.2 U5.4(VOUT)
+2V8: C27.1 R35.2 U2.4(VOUT)
+3V3: C28.1 C40.1 C43.1 C149.1 Q16.2(S1) R182.2 R267.1 R271.2 R273.2 R274.2 U2.1(EN) U2.6(VIN) U5.1(EN) U5.6(VIN) U6.1(EN) U6.6(VIN) U20.7(VOUT) U20.8(VOUT)
+3V3_LED: LD5.2(A) Q16.4(D1) R267.2
+3V3_ON: C150.1 C151.1 C221.1 C229.1 C230.1 L24.2 R180.2 R254.2 R258.2 U20.1(VIN) U20.2(VIN)
+5V: C222.1 C223.1 DS32.2(A) LD4.2(A) Q14.1(S_1) Q14.2(S_2) Q14.3(S_3) Q15.5(E2) Q17.2(S1) R268.1 R272.2 U27.7(VIN2) U27.8(VIN2) U27.12(EN2)
+5V_DEV: Q17.4(D1) R268.2
+5V_INT: C220.1 C227.1 C228.1 L23.2 Q14.5(D_5) Q15.6(E1) R255.2 R257.2
+5V_USB_DBG: DS33.2(A)
+VALIM: C224.1 C225.1 F1.2 TVS1.1(C) U27.4(VIN1) U27.5(VIN1) U27.11(EN1)
GND_DIGITAL: C27.2 C28.2 C39.2 C40.2 C42.2 C43.2 C149.2 C150.2 C151.2 C152.2 C212.1 C213.1 C214.1 C215.1 C216.1 C217.1 C222.2 C223.2 C224.2 C225.2 C226.2 C227.2 C228.2 C229.2 C230.2 J7.2(-) J7.3(NC) J21.2 Q13.2(S) Q16.5(S2) Q17.5(S2) R37.1 R46.1 R52.1 R67.1 R260.1 R262.1 R263.1 R264.1 R265.1 R266.1 TP21.1(TP) TVS1.2(A) U2.2(GND) U2.7(EXP) U5.2(GND) U5.7(EXP) U6.2(GND) U6.7(EXP) U20.9(EXP) U27.2(GND) U27.10(GND) U27.33(GND) U27.34(GND) U27.35(GND) U27.36(GND) U27.37(GND) U27.38(GND)
FB_3V3: C221.2 R258.1 R266.2 U27.31(FB2)
FB_5V: C220.2 R257.1 R265.2 U27.28(FB1)
PW_EN_LED: Q13.1(G) Q16.1(G2) R273.1 ; off-sheet PW_EN_LED
PW_ON_3V3: R180.1 U20.3(EN) ; off-sheet PW_ON_3V3
PW_ON_5V: Q17.1(G2) R274.1 ; off-sheet PW_ON_5V
VIN_CON: DS2.2(A) J21.1
VIN_JACK: DS3.2(A) J7.1A(+) J7.1B(+)
NetC152_1: C152.1 U20.4(SS)
NetC212_2: C212.2 R251.1 R256.1 U27.32(VC2)
NetC213_2: C213.2 R251.2
NetC214_2: C214.2 U27.30(SS2)
NetC215_2: C215.2 U27.29(SS1)
NetC216_2: C216.2 R252.2
NetC217_2: C217.2 R252.1 R253.1 U27.27(VC1)
NetC218_1: C218.1 U27.24(BST1)
NetC218_2: C218.2 L23.1 U27.22(SW1) U27.23(SW1)
NetC219_1: C219.1 U27.18(BST2)
NetC219_2: C219.2 L24.1 U27.19(SW2) U27.20(SW2)
NetC226_1: C226.1 R253.2 R256.2 R259.2 U27.25(VCC)
NetDS2_1: DS2.1(C) DS3.1(C) DS32.1(C) DS33.1(C) F1.1
NetLD4_1: LD4.1(C) R66.2
NetLD5_1: LD5.1(C) R67.2
NetQ13_3: Q13.3(D) R66.1
NetQ14_4: Q14.4(G) Q15.4(C2) R260.2
NetQ15_1: Q15.1(C1) Q15.2(B1) Q15.3(B2) R262.2
NetQ16_3: Q16.3(G1) R269.1 R271.1
NetQ16_6: Q16.6(D2) R269.2
NetQ17_3: Q17.3(G1) R270.1 R272.1
NetQ17_6: Q17.6(D2) R270.2
NetR35_1: R35.1 R37.2 U2.5(ADJ)
NetR42_1: R42.1 R46.2 U5.5(ADJ)
NetR49_1: R49.1 R52.2 U6.5(ADJ)
NetR182_1: R182.1 U20.6(DIS)
NetR254_1: R254.1 R255.1 U27.26(BIAS)
NetR259_1: R259.1 R264.2 U27.16(SYNC)
NetR263_2: R263.2 U27.1(RT)

Not connected (* = marked no-connect by the designer): U2 3(PG); U5 3(PG); U6 3(PG); U20 5(PG); U27 13(TEMP) 14(PG1) 15(PG2) 17(CLKOUT)

### Notes on the sheet
- +6V-30v/max 3.5A
- max 3.5A
- 2.5A
- +5V/2.5A
- (near U27) AreaPCB
- +3.3V/2.5A
- 2 cm2 Dissipation
  Area
- +1.5V/500mA
- +1.8V/250mA
- +2.8V/25mA
- AreaPCB 1cmx1cm
- AreaPCB 1.7cmx1.7cm
- 1.5A
- (near Q16) Load Switch
- (near Q17) Load Switch
- (in symbol BUCK-2X-LT8650SEV- 4A/ADJ) 2x-BUCK
- (in symbol LED R - GENERICO - 0603) R
- (in symbol MyFAEVuoto) Project; Page name; Board; Designer; Project Code; Customer; Internal Code; Code; Data; Rev.; Rev. changes; Sheet; /
- (in symbol N-P MOS-FDC6327C-2.7A/1.9A/20V) p; n
- (in symbol NMOS - BSS138 - 0.2A/50V) n
- (in symbol PMOS - SISS27DN - 23A/30V) p
- (in symbol PNPPNP - DMMT5401-7-F-0.2A/150V) pnp
- (in symbol PSW - 1x - AP22800HB-7) PW / SWITCH
- (in symbol RAPIDO - 0154003.DR - 3A/125V) 3A/125V

### Library data of the parts
C27 C28 = CS-C-0402-1u/16-X5R: CHIP CAP.CER. 1uF 16V 10% X5R 0402; MPN: Generic; Pkg Type: SMD; Room: POWER 2V8; Mount: Yes
C39 C40 = CS-C-0402-1u/16-X5R: CHIP CAP.CER. 1uF 16V 10% X5R 0402; MPN: Generic; Pkg Type: SMD; Room: POWER 1V8; Mount: Yes
C42 C43 = CS-C-0402-1u/16-X5R: CHIP CAP.CER. 1uF 16V 10% X5R 0402; MPN: Generic; Pkg Type: SMD; Room: POWER 1V5; Mount: Yes
C149 = CS-C-0402-1u/16-X5R: CHIP CAP.CER. 1uF 16V 10% X5R 0402; MPN: Generic; Pkg Type: SMD; Room: SWITCH-PW-3V3; Mount: Yes
C150 C151 = CS-C-0402-10u/6V3-X5R: CHIP CAP.CER. 10uF 6.3V 20% X5R 0402; MPN: Generic; Alternative MPN: CC0402MRX5R5BB106; Pkg Type: SMD; Room: SWITCH-PW-3V3; Temperature range: -55°..+85°; Mount: Yes
C152 = CS-C-0402-100n/16V: CHIP CAP.CER. 100nF 16V 10% X7R 0402; MPN: Generic; Alternative MPN: C0402C104K4RACTU; Room: SWITCH-PW-3V3; Pkg Type: SMD; Mount: Yes
C212 C217 = CS-C-0402: CHIP CAP.CER. 0402; MPN: Generic; Room: POWER 5V-3V3; Pkg Type: SMD; Mount: No
C213 C216 = CS-C-0402-220p/50V: CHIP CAP.CER. 220pF 50V 10% X7R 0402; MPN: Generic; Room: POWER 5V-3V3; Pkg Type: SMD; Mount: Yes
C214 C215 = CS-C-0402-10n/50V: CHIP CAP.CER. 10nF 50V 10% X7R 0402; MPN: Generic; Alternative MPN: C0402C103K5RACTU; Room: POWER 5V-3V3; Pkg Type: SMD; Mount: Yes
C218 C219 = CS-C-0402: CHIP CAP.CER. 0402; MPN: Generic; Pkg Type: SMD; Mount: No
C220 C221 = CS-C-0402-4.7p/50V-C0G: CHIP CAP.CER. 4.7pF 50V 5% C0G 0402; MPN: Generic; Pkg Type: SMD; Room: POWER 5V-3V3; Temperature range: -55°..+125°; Mount: Yes
C222 C224 = CS-C-1206-22u/25V-X5R: CHIP CAP.CER. 22uF 25V 10% X5R 1206; MPN: Generic; Room: POWER 5V-3V3; Pkg Type: SMD; Temperature range: -55°..+85°; Mount: Yes
C223 C225 = CS-C-0603-100n/50V: CHIP CAP.CER. 100nF 50V 10% X7R 0603; MPN: Generic; Alternative MPN: C0402C104K4RACTU; Room: POWER 5V-3V3; Pkg Type: SMD; Mount: Yes
C226 = CS-C-0402-1u/16-X5R: CHIP CAP.CER. 1uF 16V 10% X5R 0402; MPN: Generic; Pkg Type: SMD; Room: POWER 5V-3V3; Mount: Yes
C227-C230 = CS-C-0603-22u/10V/X5R: CHIP CAP.CER. 22uF 10V 20% X5R 0603; MPN: Generic; Pkg Type: SMD; Room: POWER 5V-3V3; Temperature range: -55°..+85°; Mount: Yes
DS2 DS3 = SCHOTTKY-CDBC560-G - 5A/60V: DIODE SCHOTTKY 5A 60V CDBC560-G DO214AB SMT; Pkg Type: SMD; Room: POWER IN; MPN: CDBC560-G; Mount: Yes
DS32 DS33 = SCHOTTKY-MBRA160 - 1A/60V: DIODE SCHOTTKY 1A 60V MBRA160T3G SMA SMT; Pkg Type: SMD; Room: POWER IN; MPN: MBRA160T3G; Mount: Yes
F1 = RAPIDO - 0154003.DR - 3A/125V: FUSE BOARD MNT 3A 125VAC/VDC SMD; Room: POWER IN; Pkg Type: SMD; MPN: 0154003-DR; Mount: Yes
J7 = JACK-PW - J-CUPJ002AH: CONN. POWER JACK F/90° PJ-002AH-SMT-TR CUI SMT; Alternative MPN: 694106106102; Pkg Type: SMD; Note: ID=2.1mm OD=5.5mm; Room: POWER IN; MPN: PJ-002AH-SMT; Mount: Yes
J21 = MC - J-2-0350-MOT-MC: TERM BLOCK HDR 2POS 90DEG 3.5MM; Pkg Type: THT; Room: POWER IN; MPN: 1920943; Mount: Yes
L23 L24 = PW-IHLP1212BZER1R0M11-1u/5A: FIXED IND 1UH 5A 24 MOHM SMD; Room: POWER 5V-3V3; Pkg Type: SMD; Temperature range: -55°..+125°; MPN: IHLP1212BZER1R0M11; Mount: Yes
LD4 LD5 = LED R - GENERICO - 0603: LED Red 0603 SMT; Alternative MPN: LTST-C191KRKT; Pkg Type: SMD; Note: 2V/20mA; Room: POWER LED; MPN: Generic; Mount: Yes
Q13 = NMOS - BSS138 - 0.2A/50V: as Q1 on sheet 01 - CML3 CONNECTOR; MPN: BSS138LT1G; Mount: Yes
Q14 = PMOS - SISS27DN - 23A/30V: MOSFET P-CH 30V 50A PPAK 1212-8S; Pkg Type: SMD; Room: POWER 5V-3V3; Temperature range: -65°..+150°; MPN: SISS27DN-T1-GE3; Mount: Yes
Q15 = PNPPNP - DMMT5401-7-F-0.2A/150V: TRANS 2PNP 150V 0.2A SOT26; Room: POWER 5V-3V3; Pkg Type: SMD; Temperature range: -55°..+150°; MPN: DMMT5401-7-F; Mount: Yes
Q16 = N-P MOS-FDC6327C-2.7A/1.9A/20V: MOSFET N/P-CH 20V SSOT-6; Room: SWITCH-PW-LED; Pkg Type: SMD; Temperature range: -55°..+150°; MPN: FDC6327C; Mount: Yes
Q17 = N-P MOS-FDC6327C-2.7A/1.9A/20V: MOSFET N/P-CH 20V SSOT-6; Room: SWITCH-PW-5V; Pkg Type: SMD; Temperature range: -55°..+150°; MPN: FDC6327C; Mount: Yes
R35 = RS-0402-24.9k: CHIP RES. 24K9 0402 1/16W 1%; MPN: Generic; Room: POWER 2V8; Pkg Type: SMD; Mount: Yes
R37 = RS-0402-10k: CHIP RES. 10K 0402 1/16W 1%; MPN: Generic; Room: POWER 2V8; Pkg Type: SMD; Temperature range: -55°..+125°; Mount: Yes
R42 = RS-0402-12.4k: CHIP RES. 12K4 0402 1/16W 1% 100PPM/°C; MPN: Generic; Room: POWER 1V8; Note: 100ppm; Pkg Type: SMD; Mount: Yes
R46 = RS-0402-10k: CHIP RES. 10K 0402 1/16W 1%; MPN: Generic; Room: POWER 1V8; Pkg Type: SMD; Temperature range: -55°..+125°; Mount: Yes
R49 = RS-0402-8.66k: CHIP RES. 8K66 0402 1/16W 1% 100PPM/°C; MPN: Generic; Room: POWER 1V5; Note: 100ppm; Pkg Type: SMD; Temperature range: -55°..+155°; Mount: Yes
R52 = RS-0402-10k: CHIP RES. 10K 0402 1/16W 1%; MPN: Generic; Room: POWER 1V5; Pkg Type: SMD; Temperature range: -55°..+125°; Mount: Yes
R66 = RS-0402-1k: as R32 on sheet 01 - CML3 CONNECTOR; Mount: Yes
R67 = RS-0402-470r: CHIP RES. 470R 0402 1/16W 1%; MPN: Generic; Pkg Type: SMD; Room: POWER LED; Mount: Yes
R180 = RS-0402-100k: CHIP RES. 100K 0402 1/16W 1%; MPN: Generic; Pkg Type: SMD; Room: SWITCH-PW-3V3; Mount: Yes
R182 = RS-1206-100r: CHIP RES. 100R 1206 1/4W 1%; MPN: Generic; Pkg Type: SMD; Room: SWITCH-PW-3V3; Mount: Yes
R251 R252 R263 = RS-0402-15k: CHIP RES. 15K 0402 1/16W 1%; MPN: Generic; Pkg Type: SMD; Room: POWER 5V-3V3; Temperature range: -55°..+155°; Mount: Yes
R253 R254 R256 R259 = RS-0402: CHIP RES. 0402; MPN: Generic; Pkg Type: SMD; Room: POWER 5V-3V3; Mount: No
R255 R264 = RS-0402-0r: CHIP RES. 0R 0402 1/16W 1%; MPN: Generic; Room: POWER 5V-3V3; Pkg Type: SMD; Mount: Yes
R257 R258 = RS-0402-1M: CHIP RES. 1M 0402 1/16W 1%; MPN: Generic; Room: POWER 5V-3V3; Pkg Type: SMD; Mount: Yes
R260 = RS-0402-47k: CHIP RES. 47K 0402 1/16W 1% 100PPM/°C; MPN: Generic; Pkg Type: SMD; Note: 100ppm; Room: POWER 5V-3V3; Mount: Yes
R262 = RS-0402-10k: CHIP RES. 10K 0402 1/16W 1%; MPN: Generic; Room: POWER 5V-3V3; Pkg Type: SMD; Temperature range: -55°..+125°; Mount: Yes
R265 = RS-0402-191k: CHIP RES. 191K 0402 1/16W 1%; MPN: Generic; Pkg Type: SMD; Room: POWER 5V-3V3; Mount: Yes
R266 = RS-0402-316k: CHIP RES. 316K 0402 1/16W 1%; MPN: Generic; Room: POWER 5V-3V3; Pkg Type: SMD; Mount: Yes
R267 = RS-0603: CHIP RES. 0603; MPN: Generic; Pkg Type: SMD; Room: SWITCH-PW-LED; Mount: No
R268 = RS-0603: CHIP RES. 0603; MPN: Generic; Pkg Type: SMD; Room: SWITCH-PW-5V; Mount: No
R269 = RS-0402-1k: CHIP RES. 1K 0402 1/16W 1%; MPN: Generic; Pkg Type: SMD; Room: SWITCH-PW-LED; Mount: Yes
R270 = RS-0402-2.2k: CHIP RES. 2K2 0402 1/16W 1%; MPN: Generic; Room: SWITCH-PW-5V; Pkg Type: SMD; Mount: Yes
R271 R273 = RS-0402-10k: CHIP RES. 10K 0402 1/16W 1%; MPN: Generic; Room: SWITCH-PW-LED; Pkg Type: SMD; Temperature range: -55°..+125°; Mount: Yes
R272 R274 = RS-0402-10k: CHIP RES. 10K 0402 1/16W 1%; MPN: Generic; Room: SWITCH-PW-5V; Pkg Type: SMD; Temperature range: -55°..+125°; Mount: Yes
TP21 = TEST POINT THT - 2.2MM: PCB Test Point, Black, - Through Hole Mount, 1.02 mm, Phosphor Bronze, Tin Plated Contacts; MPN: 20-2137; Pkg Type: THT; Room: POWER IN; Mount: Yes
TVS1 = TVS-UNI - SMBJ36A - 36V/600W: TVS DIODE 36VWM 58.1VC SMB; Room: POWER IN; Pkg Type: SMD; Note: Unidirectional; MPN: SMBJ36A; Mount: Yes
U2 = LDO - LD39050PUR - 0.5A/ADJ: Linear Voltage Regulator IC Positive Adjustable 1 Output 500mA 6-DFN (3x3); Pkg Type: SMD; Room: POWER 2V8; Temperature range: -40°..+125°; MPN: LD39050PUR; Mount: Yes
U5 = LDO - LD39050PUR - 0.5A/ADJ: Linear Voltage Regulator IC Positive Adjustable 1 Output 500mA 6-DFN (3x3); Pkg Type: SMD; Room: POWER 1V8; Temperature range: -40°..+125°; MPN: LD39050PUR; Mount: Yes
U6 = LDO - LD39050PUR - 0.5A/ADJ: Linear Voltage Regulator IC Positive Adjustable 1 Output 500mA 6-DFN (3x3); Pkg Type: SMD; Room: POWER 1V5; Temperature range: -40°..+125°; MPN: LD39050PUR; Mount: Yes
U20 = PSW - 1x - AP22800HB-7: IC PWR SWITCH N-CHAN 1:1 8UDFN; Pkg Type: SMD; Note: 1.5 -5.5V - 16mOHM; Power requirements: xV: 21uA; Room: SWITCH-PW-3V3; Temperature range: -40°..+85°; MPN: AP22800HB-7; Mount: Yes
U27 = BUCK-2X-LT8650SEV- 4A/ADJ: IC REG BCK 3.3V/5V 4A DL 32LQFN; Pkg Type: SMD; Note: 300kHz - 3MHz - VIN=3V - 42V; Room: POWER 5V-3V3; Temperature range: -40°..+125°; MPN: LT8650SEV; Mount: Yes
XJ21 = MORS.ESTR. - MC-3.50-2P: 2 Position Terminal Block Plug, Female Sockets 0.138" (3.50mm) - 180° Free Hanging (In-Line); Pkg Type: THT; Room: POWER IN; MPN: 1916384; Mount: Yes
*#2 = MyFAEVuoto: Page Count: 11; Customer Code: -; Database: -

## Sheet 03 - WIFI - BLE.SchDoc
size 420 x 297 mm
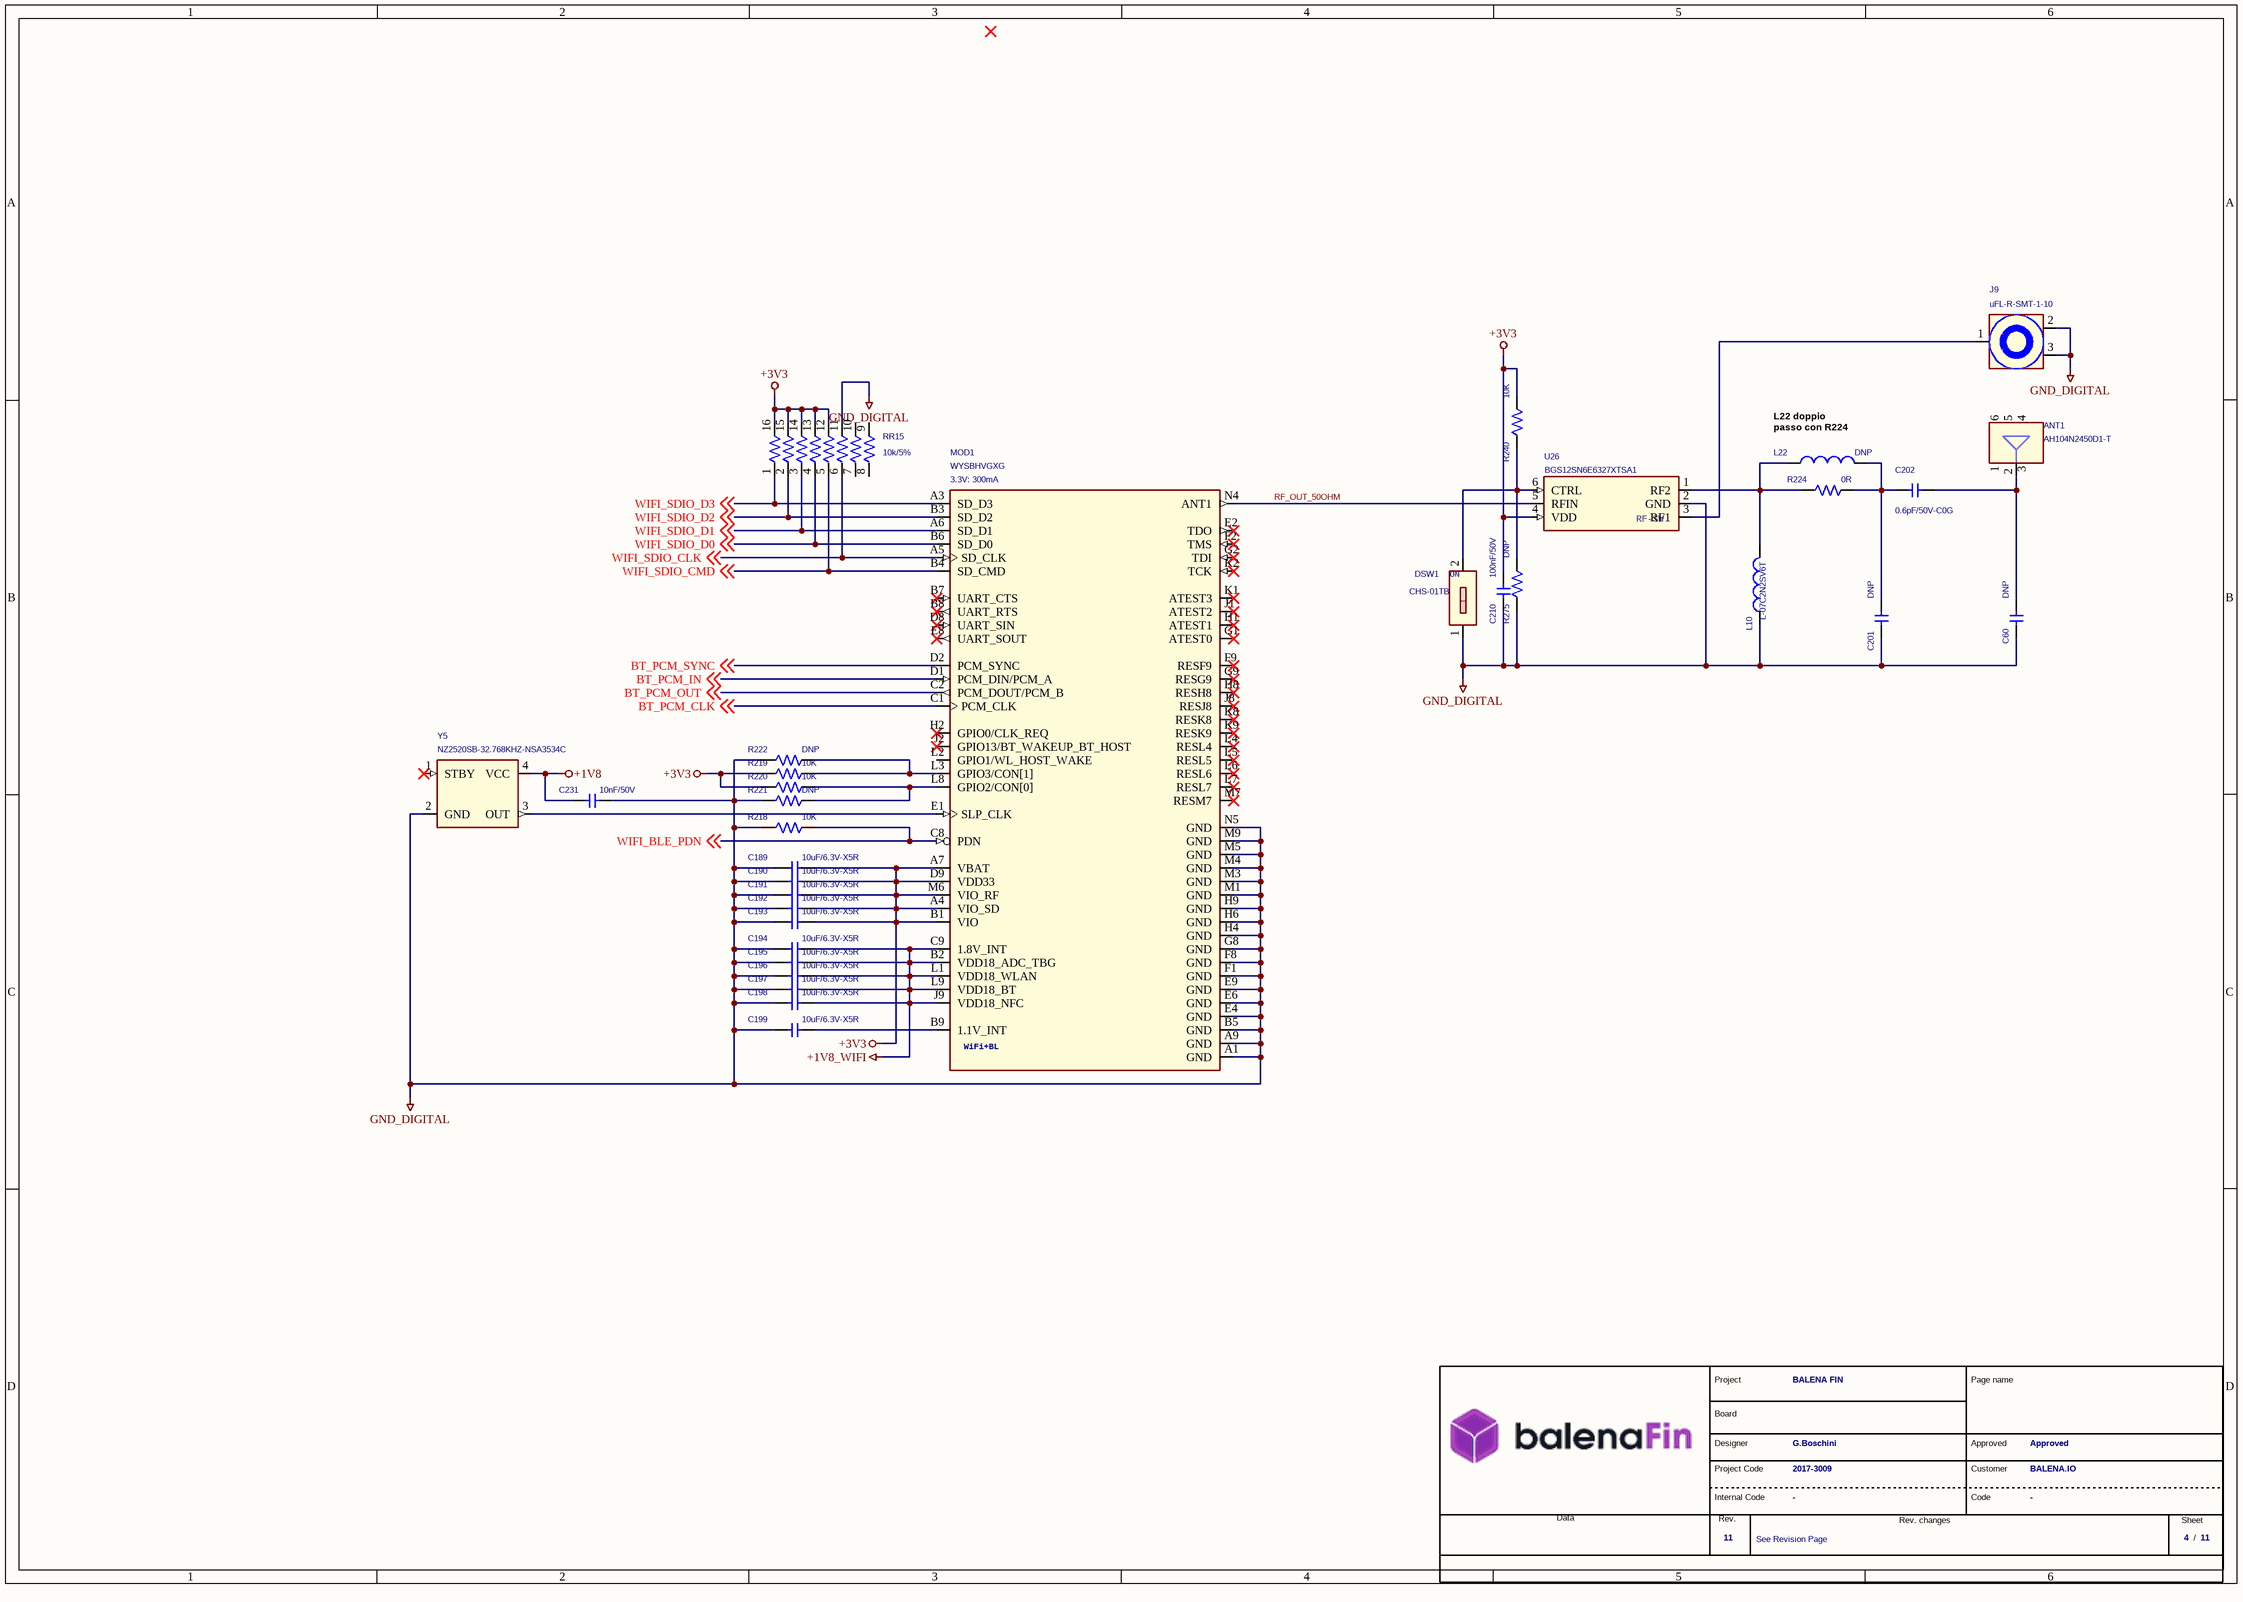
[diagram p5: 03 - WIFI - BLE.SchDoc]

### Parts
(Parts that share a designator on the sheet are numbered #1, #2 ... from top to bottom, then left to right.)
*#3  Revision: 11  FAE RD code: 2017-3009  DocumentoRev: See Revision Page  Page Number: 4  Nome Progetto: BALENA FIN  Customer name: BALENA.IO  Project manager: Approved  Project designer: G.Boschini  (hidden comment: MyFAEVuoto)  (graphical)
ANT1  AH104N2450D1-T  [ANT-AH104N]
C60  DNP  [CS-C-0402]
C189  10uF/6.3V-X5R  [CS-C-0402]
C190  10uF/6.3V-X5R  [CS-C-0402]
C191  10uF/6.3V-X5R  [CS-C-0402]
C192  10uF/6.3V-X5R  [CS-C-0402]
C193  10uF/6.3V-X5R  [CS-C-0402]
C194  10uF/6.3V-X5R  [CS-C-0402]
C195  10uF/6.3V-X5R  [CS-C-0402]
C196  10uF/6.3V-X5R  [CS-C-0402]
C197  10uF/6.3V-X5R  [CS-C-0402]
C198  10uF/6.3V-X5R  [CS-C-0402]
C199  10uF/6.3V-X5R  [CS-C-0402]
C201  DNP  [CS-C-0402]
C202  0.6pF/50V-C0G  [CS-C-0402]
C210  100nF/50V  [CS-C-0402]
C231  10nF/50V  [CS-C-0402]
DSW1  CHS-01TB  [DSS-CHS-01TB]
J9  uFL-R-SMT-1-10  [J-3-MDS-UFL]
L10  L-07C2N2SV6T  [LS-0402]
L22  DNP  [LS-0402]
MOD1  WYSBHVGXG  Power requirements: 3.3V: 300mA  [MOD-WYSBHVGXG]
R218  10K  [RS-0402]
R219  10K  [RS-0402]
R220  10K  [RS-0402]
R221  DNP  [RS-0402]
R222  DNP  [RS-0402]
R224  0R  [RS-0402]
R240  10K  [RS-0402]
R275  DNP  [RS-0402]
RR15  10k/5%  [RR-8X-1506]
U26  BGS12SN6E6327XTSA1  [XFDFN6]
Y5  NZ2520SB-32.768KHZ-NSA3534C  [Y-NZ2520S]

### Nets
+1V8: C231.1 Y5.4(VCC)
+1V8_WIFI: C194.2 C195.2 C196.2 C197.2 C198.2 MOD1.B2(VDD18_ADC_TBG) MOD1.C9(1.8V_INT) MOD1.J9(VDD18_NFC) MOD1.L1(VDD18_WLAN) MOD1.L9(VDD18_BT)
+3V3: C189.2 C190.2 C191.2 C192.2 C193.2 C210.2 MOD1.A4(VIO_SD) MOD1.A7(VBAT) MOD1.B1(VIO) MOD1.D9(VDD33) MOD1.M6(VIO_RF) R219.1 R220.1 R240.2 RR15.12 RR15.13 RR15.14 RR15.15 RR15.16 U26.4(VDD)
GND_DIGITAL: C60.2 C189.1 C190.1 C191.1 C192.1 C193.1 C194.1 C195.1 C196.1 C197.1 C198.1 C199.1 C201.2 C210.1 C231.2 DSW1.1 J9.2 J9.3 L10.1(C) MOD1.A1(GND) MOD1.A9(GND) MOD1.B5(GND) MOD1.E4(GND) MOD1.E6(GND) MOD1.E9(GND) MOD1.F1(GND) MOD1.F8(GND) MOD1.G8(GND) MOD1.H4(GND) MOD1.H6(GND) MOD1.H9(GND) MOD1.M1(GND) MOD1.M3(GND) MOD1.M4(GND) MOD1.M5(GND) MOD1.M9(GND) MOD1.N5(GND) R218.1 R221.1 R222.1 R275.1 RR15.11 U26.2(GND) Y5.2(GND)
BT_PCM_CLK: MOD1.C1(PCM_CLK) ; off-sheet BT_PCM_CLK
BT_PCM_IN: MOD1.D1(PCM_DIN/PCM_A) ; off-sheet BT_PCM_IN
BT_PCM_OUT: MOD1.C2(PCM_DOUT/PCM_B) ; off-sheet BT_PCM_OUT
BT_PCM_SYNC: MOD1.D2(PCM_SYNC) ; off-sheet BT_PCM_SYNC
RF_OUT_50OHM: MOD1.N4(ANT1) U26.5(RFIN)
WIFI_BLE_PDN: MOD1.C8(PDN) R218.2 ; off-sheet WIFI_BLE_PDN
WIFI_SDIO_CLK: MOD1.A5(SD_CLK) RR15.6 ; off-sheet WIFI_SDIO_CLK
WIFI_SDIO_CMD: MOD1.B4(SD_CMD) RR15.5 ; off-sheet WIFI_SDIO_CMD
WIFI_SDIO_D0: MOD1.B6(SD_D0) RR15.4 ; off-sheet WIFI_SDIO_D0
WIFI_SDIO_D1: MOD1.A6(SD_D1) RR15.3 ; off-sheet WIFI_SDIO_D1
WIFI_SDIO_D2: MOD1.B3(SD_D2) RR15.2 ; off-sheet WIFI_SDIO_D2
WIFI_SDIO_D3: MOD1.A3(SD_D3) RR15.1 ; off-sheet WIFI_SDIO_D3
NetANT1_2: ANT1.2 C60.1 C202.2
NetC199_2: C199.2 MOD1.B9(1.1V_INT)
NetC201_1: C201.1 C202.1 L22.2(A) R224.2
NetDSW1_2: DSW1.2 R240.1 R275.2 U26.6(CTRL)
NetJ9_1: J9.1 U26.3(RF1)
NetL10_2: L10.2(A) L22.1(C) R224.1 U26.1(RF2)
NetMOD1_E1: MOD1.E1(SLP_CLK) Y5.3(OUT)
NetMOD1_L3: MOD1.L3(GPIO3/CON[1]) R219.2 R222.2
NetMOD1_L8: MOD1.L8(GPIO2/CON[0]) R220.2 R221.2

Not connected (* = marked no-connect by the designer): ANT1 1 3 4 5 6; MOD1 B7(UART_CTS)* B8(UART_RTS)* D8(UART_SIN)* E2(TDO)* E8(UART_SOUT)* F2(TMS)* F9(RESF9)* G1(ATEST0)* G2(TDI)* G9(RESG9)* H1(ATEST1)* H2(GPIO0/CLK_REQ)* H8(RESH8)* J1(ATEST2)* J2(GPIO13/BT_WAKEUP_BT_HOST)* J8(RESJ8)* K1(ATEST3)* K2(TCK)* K8(RESK8)* K9(RESK9)* L2(GPIO1/WL_HOST_WAKE) L4(RESL4)* L5(RESL5)* L6(RESL6)* L7(RESL7)* M7(RESM7)*; RR15 7 8 9 10; Y5 1(STBY)*

### Notes on the sheet
- (near L22) L22 doppio
  passo con R224
- (in symbol DIP-SW-1x-CHS-01TB-SMD) ON
- (in symbol MyFAEVuoto) Project; Page name; Board; Designer; Project Code; Customer; Internal Code; Code; Data; Rev.; Rev. changes; Sheet; /
- (in symbol RF-SW - BGS12SN6E6327XTSA1) RF-SW
- (in symbol WIFI-BLE - WYSBHVGXG) WiFi+BL

### Library data of the parts
ANT1 = ANT - AH104N2450D1-T - 2.4G-5G: 2.4GHz, 5.4GHz WLAN Chip RF Antenna 2.4GHz ~ 2.5GHz, 4.9GHz ~ 5.85GHz 2.1dBi,  2.4dBi; Pkg Type: SMD; Room: WIFI-BLUETOOTH; Temperature range: -40°..+85°; MPN: AH104N2450D1-T; Mount: Yes
C60 C201 = CS-C-0402: CHIP CAP.CER. 0402; MPN: Generic; Room: WIFI-BLUETOOTH; Pkg Type: SMD; Mount: No
C189-C199 = CS-C-0402-10u/6V3-X5R: CHIP CAP.CER. 10uF 6.3V 20% X5R 0402; MPN: Generic; Alternative MPN: CC0402MRX5R5BB106; Pkg Type: SMD; Room: WIFI-BLUETOOTH; Temperature range: -55°..+85°; Mount: Yes
C202 = CS-C-0402-0.6p/50V-C0G: CHIP CAP.CER. 0.6pF 50V ±0.1pF C0G 0402; MPN: Generic; Room: WIFI-BLUETOOTH; Pkg Type: SMD; Note: RF; Temperature range: -55°..+125°; Mount: Yes
C210 = CS-C-0402-100n/16V: CHIP CAP.CER. 100nF 16V 10% X7R 0402; MPN: Generic; Alternative MPN: C0402C104K4RACTU; Room: WIFI-BLUETOOTH; Pkg Type: SMD; Mount: Yes
C231 = CS-C-0402-10n/50V: CHIP CAP.CER. 10nF 50V 10% X7R 0402; MPN: Generic; Alternative MPN: C0402C103K5RACTU; Room: WIFI-BLUETOOTH; Pkg Type: SMD; Mount: Yes
DSW1 = DIP-SW-1x-CHS-01TB-SMD: Dip Switch SPST 1 Position - Surface Mount Slide (Standard) - Actuator 100mA 6VDC; Pkg Type: SMD; Room: WIFI-BLUETOOTH; Temperature range: -40°..+85°; MPN: CHS-01TB; Mount: Yes
J9 = UFL - U-FL-R-SMT-1-10: CONN. RF M U.FL-R-SMT-1(10) HIROSE SMT; Pkg Type: SMD; Note: 50ohm; Room: WIFI-BLUETOOTH; Temperature range: -40°..+90°; MPN: uFL-R-SMT-1-10; Mount: Yes
L10 = L - L-07C2N2SV6T-2.2n/0.3A: FIXED IND 2.2NH 300MA 160MOHM SM; Pkg Type: SMD; Room: WIFI-BLUETOOTH; Temperature range: -40°..+100°; MPN: L-07C2N2SV6T; Mount: Yes
L22 = L - L-07C1N8SV6T-1.8n/0.3A: FIXED IND 1.8NH 300MA 140MOHM SM; MPN: Generic; Pkg Type: SMD; Room: WIFI-BLUETOOTH; Mount: No; Temperature range: -40°..+100°
MOD1 = WIFI-BLE - WYSBHVGXG: WiFi 802.11a/b/g/n, Bluetooth v4.2 Module 2.4GHz, 5GHz; Room: WIFI-BLUETOOTH; Pkg Type: SMD; Note: 2.4G - 5G - BLE 4.2; Temperature range: -30°..+85°; MPN: WYSBHVGXG; Mount: Yes
R218-R220 R240 = RS-0402-10k: CHIP RES. 10K 0402 1/16W 1%; MPN: Generic; Room: WIFI-BLUETOOTH; Pkg Type: SMD; Temperature range: -55°..+125°; Mount: Yes
R221 R222 R275 = RS-0402: CHIP RES. 0402; MPN: Generic; Pkg Type: SMD; Room: WIFI-BLUETOOTH; Mount: No
R224 = RS-0402-0r: CHIP RES. 0R 0402 1/16W 1%; MPN: Generic; Room: WIFI-BLUETOOTH; Pkg Type: SMD; Mount: Yes
RR15 = RR-8X-1506-10k/5%: RES ARRAY 8 RES 10K OHM 1506 5%; MPN: Generic; Alternative MPN: CAY16-103J8LF; Room: WIFI-BLUETOOTH; Note: 200ppm; Pkg Type: SMD; Temperature range: -55°..+125°; Mount: Yes
U26 = RF-SW - BGS12SN6E6327XTSA1: IC RF SWITCH SPDT 6GHZ TSNP6-2; Pkg Type: SMD; Note: 100MHz to 6GHz; Power requirements: xV: xmA; Room: WIFI-BLUETOOTH; Temperature range: -40°..+85°; MPN: BGS12SN6E6327XTSA1; Mount: Yes
Y5 = OSCILLATORE - NZ2520SB-32.768K: 32.768kHz XO (Standard) CMOS Oscillator 15pF 1.8V  30ppm 1.8V Standby (Power  Down) 4-SMD, No Lead; Pkg Type: SMD; Room: WIFI-BLUETOOTH; Temperature range: -40°..+85°; MPN: NZ2520SB-32.768KHZ-NSA3534C; Mount: Yes
*#3 = MyFAEVuoto: Page Count: 11; Customer Code: -; Database: -

## Sheet 04 - MIPI INTERFACE.SchDoc
size 420 x 297 mm
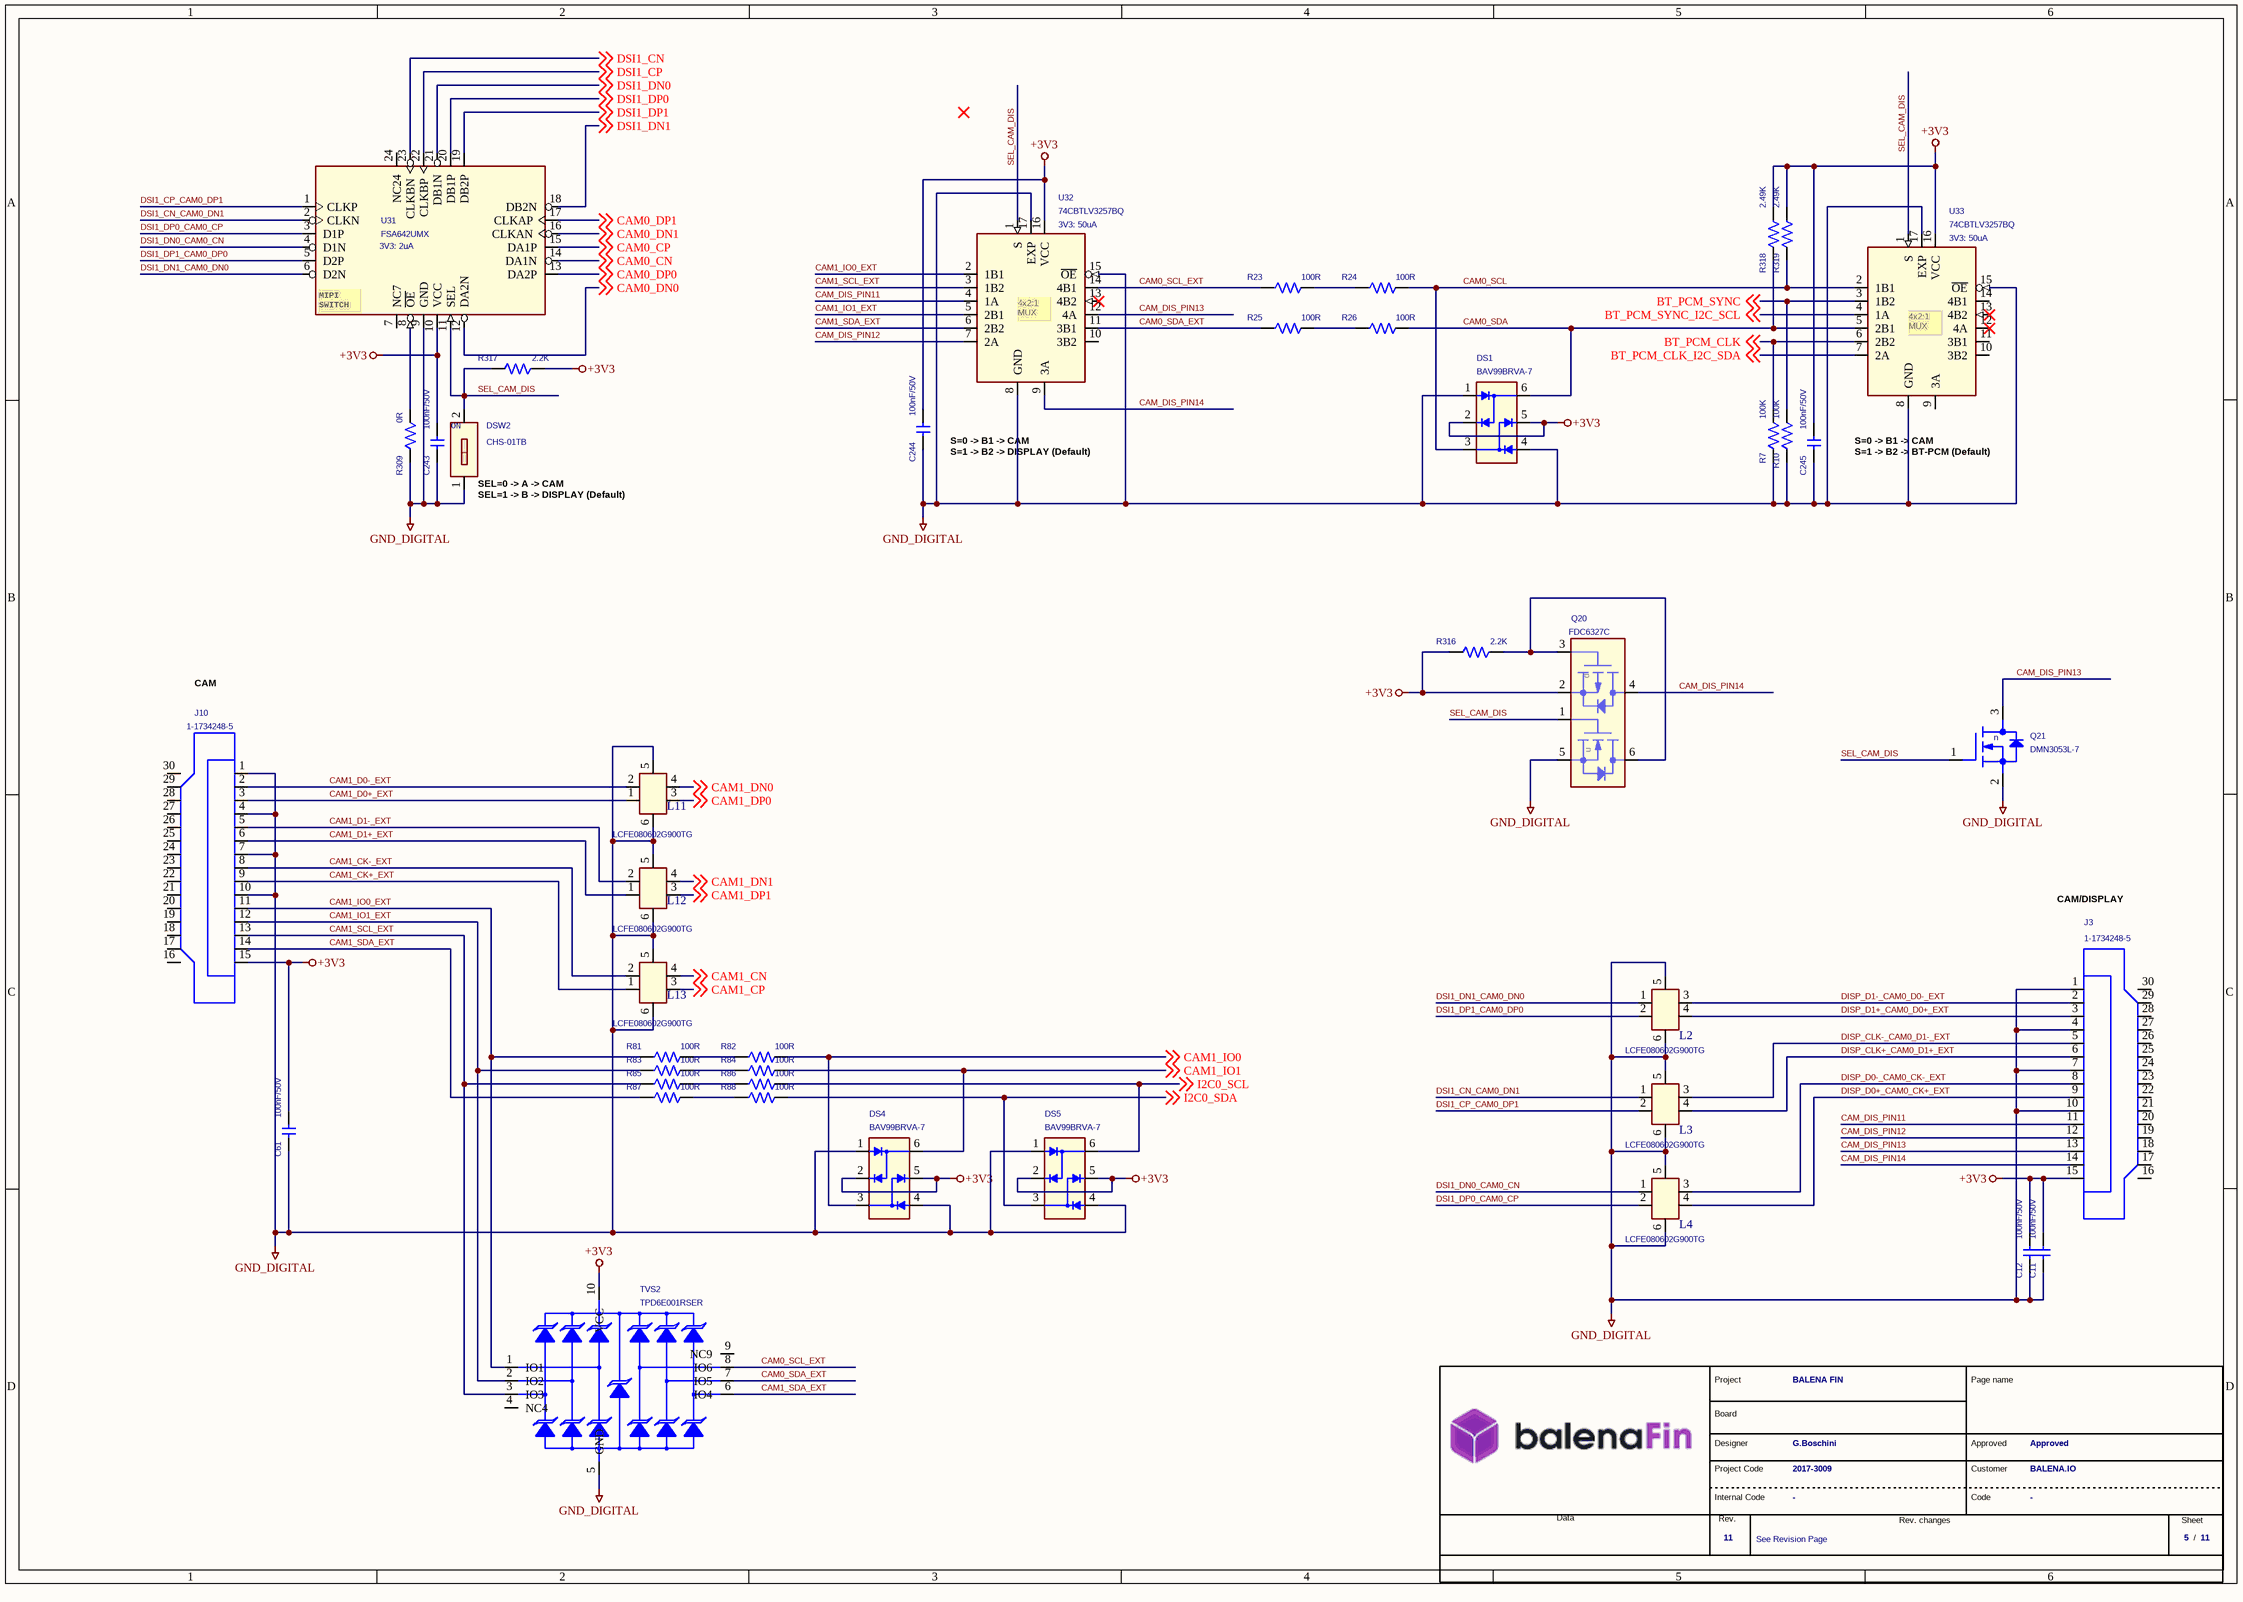
[diagram p6: 04 - MIPI INTERFACE.SchDoc]

### Parts
(Parts that share a designator on the sheet are numbered #1, #2 ... from top to bottom, then left to right.)
*#4  Revision: 11  FAE RD code: 2017-3009  DocumentoRev: See Revision Page  Page Number: 5  Nome Progetto: BALENA FIN  Customer name: BALENA.IO  Project manager: Approved  Project designer: G.Boschini  (hidden comment: MyFAEVuoto)  (graphical)
C11  100nF/50V  [CS-C-0402]
C12  100nF/50V  [CS-C-0402]
C61  100nF/50V  [CS-C-0402]
C243  100nF/50V  [CS-C-0402]
C244  100nF/50V  [CS-C-0402]
C245  100nF/50V  [CS-C-0402]
DS1  BAV99BRVA-7  [SOT563]
DS4  BAV99BRVA-7  [SOT563]
DS5  BAV99BRVA-7  [SOT563]
DSW2  CHS-01TB  [DSS-CHS-01TB]
J3  1-1734248-5  [J-15X2-0100-FDS-ZIF]
J10  1-1734248-5  [J-15X2-0100-FDS-ZIF]
L2  LCFE080602G900TG  [LCFE080602G900TG]
L3  LCFE080602G900TG  [LCFE080602G900TG]
L4  LCFE080602G900TG  [LCFE080602G900TG]
L11  LCFE080602G900TG  [LCFE080602G900TG]
L12  LCFE080602G900TG  [LCFE080602G900TG]
L13  LCFE080602G900TG  [LCFE080602G900TG]
Q20  FDC6327C  [SOT23-6-DBV]
Q21  DMN3053L-7  [SOT23]
R7  100K  [RS-0402]
R10  100K  [RS-0402]
R23  100R  [RS-0402]
R24  100R  [RS-0402]
R25  100R  [RS-0402]
R26  100R  [RS-0402]
R81  100R  [RS-0402]
R82  100R  [RS-0402]
R83  100R  [RS-0402]
R84  100R  [RS-0402]
R85  100R  [RS-0402]
R86  100R  [RS-0402]
R87  100R  [RS-0402]
R88  100R  [RS-0402]
R309  0R  [RS-0402]
R316  2.2K  [RS-0402]
R317  2.2K  [RS-0402]
R318  2.49K  [RS-0402]
R319  2.49K  [RS-0402]
TVS2  TPD6E001RSER  [UFQFN10]
U31  FSA642UMX  Power requirements: 3V3: 2uA  [UFQFN24-0250X0340]
U32  74CBTLV3257BQ  Power requirements: 3V3: 50uA  [VFQFN16-EXP-0250X0300]
U33  74CBTLV3257BQ  Power requirements: 3V3: 50uA  [VFQFN16-EXP-0250X0300]

### Nets
+3V3: C11.1 C12.1 C61.1 C243.1 C244.1 C245.1 DS1.2(C1) DS1.5(C2) DS4.2(C1) DS4.5(C2) DS5.2(C1) DS5.5(C2) J3.15 J10.15 Q20.2(S1) R316.2 R317.1 R318.1 R319.1 TVS2.10(VCC) U31.10(VCC) U32.16(VCC) U33.16(VCC)
GND_DIGITAL: C11.2 C12.2 C61.2 C243.2 C244.2 C245.2 DS1.1(A1) DS1.4(A2) DS4.1(A1) DS4.4(A2) DS5.1(A1) DS5.4(A2) DSW2.1 J3.1 J3.4 J3.7 J3.10 J10.1 J10.4 J10.7 J10.10 L2.5 L2.6 L3.5 L3.6 L4.5 L4.6 L11.5 L11.6 L12.5 L12.6 L13.5 L13.6 Q20.5(S2) Q21.2(S) R7.1 R10.1 R309.1 TVS2.5(GND) U31.9(GND) U32.8(GND) U32.15(~{OE}) U32.17(EXP) U33.8(GND) U33.15(~{OE}) U33.17(EXP)
BT_PCM_CLK: R7.2 U33.6(2B2) ; off-sheet BT_PCM_CLK
BT_PCM_CLK_I2C_SDA: U33.7(2A) ; off-sheet BT_PCM_CLK_I2C_SDA
BT_PCM_SYNC: R10.2 U33.3(1B2) ; off-sheet BT_PCM_SYNC
BT_PCM_SYNC_I2C_SCL: U33.4(1A) ; off-sheet BT_PCM_SYNC_I2C_SCL
CAM0_CN: U31.14(DA1N) ; off-sheet CAM0_CN
CAM0_CP: U31.15(DA1P) ; off-sheet CAM0_CP
CAM0_DN0: U31.12(DA2N) ; off-sheet CAM0_DN0
CAM0_DN1: U31.16(CLKAN) ; off-sheet CAM0_DN1
CAM0_DP0: U31.13(DA2P) ; off-sheet CAM0_DP0
CAM0_DP1: U31.17(CLKAP) ; off-sheet CAM0_DP1
CAM0_SCL: DS1.3(AC2) R24.2 R319.2 U33.2(1B1)
CAM0_SCL_EXT: R23.1 TVS2.8(IO6) U32.14(4B1)
CAM0_SDA: DS1.6(AC1) R26.2 R318.2 U33.5(2B1)
CAM0_SDA_EXT: R25.1 TVS2.7(IO5) U32.11(3B1)
CAM1_CK+_EXT: J10.9 L13.1
CAM1_CK-_EXT: J10.8 L13.2
CAM1_CN: L13.4 ; off-sheet CAM1_CN
CAM1_CP: L13.3 ; off-sheet CAM1_CP
CAM1_D0+_EXT: J10.3 L11.1
CAM1_D0-_EXT: J10.2 L11.2
CAM1_D1+_EXT: J10.6 L12.1
CAM1_D1-_EXT: J10.5 L12.2
CAM1_DN0: L11.4 ; off-sheet CAM1_DN0
CAM1_DN1: L12.4 ; off-sheet CAM1_DN1
CAM1_DP0: L11.3 ; off-sheet CAM1_DP0
CAM1_DP1: L12.3 ; off-sheet CAM1_DP1
CAM1_IO0: DS4.3(AC2) R82.2 ; off-sheet CAM1_IO0
CAM1_IO0_EXT: J10.11 R81.1 TVS2.1(IO1) U32.2(1B1)
CAM1_IO1: DS4.6(AC1) R84.2 ; off-sheet CAM1_IO1
CAM1_IO1_EXT: J10.12 R83.1 TVS2.2(IO2) U32.5(2B1)
CAM1_SCL_EXT: J10.13 R85.1 TVS2.3(IO3) U32.3(1B2)
CAM1_SDA_EXT: J10.14 R87.1 TVS2.6(IO4) U32.6(2B2)
CAM_DIS_PIN11: J3.11 U32.4(1A)
CAM_DIS_PIN12: J3.12 U32.7(2A)
CAM_DIS_PIN13: J3.13 Q21.3(D) U32.12(4A)
CAM_DIS_PIN14: J3.14 Q20.4(D1) U32.9(3A)
DISP_CLK+_CAM0_D1+_EXT: J3.6 L3.4
DISP_CLK-_CAM0_D1-_EXT: J3.5 L3.3
DISP_D0+_CAM0_CK+_EXT: J3.9 L4.4
DISP_D0-_CAM0_CK-_EXT: J3.8 L4.3
DISP_D1+_CAM0_D0+_EXT: J3.3 L2.4
DISP_D1-_CAM0_D0-_EXT: J3.2 L2.3
DSI1_CN: U31.23(CLKBN) ; off-sheet DSI1_CN
DSI1_CN_CAM0_DN1: L3.1 U31.2(CLKN)
DSI1_CP: U31.22(CLKBP) ; off-sheet DSI1_CP
DSI1_CP_CAM0_DP1: L3.2 U31.1(CLKP)
DSI1_DN0: U31.21(DB1N) ; off-sheet DSI1_DN0
DSI1_DN0_CAM0_CN: L4.1 U31.4(D1N)
DSI1_DN1: U31.18(DB2N) ; off-sheet DSI1_DN1
DSI1_DN1_CAM0_DN0: L2.1 U31.6(D2N)
DSI1_DP0: U31.20(DB1P) ; off-sheet DSI1_DP0
DSI1_DP0_CAM0_CP: L4.2 U31.3(D1P)
DSI1_DP1: U31.19(DB2P) ; off-sheet DSI1_DP1
DSI1_DP1_CAM0_DP0: L2.2 U31.5(D2P)
I2C0_SCL: DS5.6(AC1) R86.2 ; off-sheet I2C0_SCL
I2C0_SDA: DS5.3(AC2) R88.2 ; off-sheet I2C0_SDA
SEL_CAM_DIS: DSW2.2 Q20.1(G2) Q21.1(G) R317.2 U31.11(SEL) U32.1(S) U33.1(S)
NetQ20_3: Q20.3(G1) Q20.6(D2) R316.1
NetR23_2: R23.2 R24.1
NetR25_2: R25.2 R26.1
NetR81_2: R81.2 R82.1
NetR83_2: R83.2 R84.1
NetR85_2: R85.2 R86.1
NetR87_2: R87.2 R88.1
NetR309_2: R309.2 U31.8(~{OE})

Not connected (* = marked no-connect by the designer): J3 16 17 18 19 20 21 22 23 24 25 26 27 28 29 30; J10 16 17 18 19 20 21 22 23 24 25 26 27 28 29 30; TVS2 4(NC4) 9(NC9); U31 7(NC7) 24(NC24); U32 10(3B2) 13(4B2)*; U33 9(3A) 10(3B2) 11(3B1) 12(4A)* 13(4B2)* 14(4B1)

### Notes on the sheet
- (near C244) S=0 -> B1 -> CAM
  S=1 -> B2 -> DISPLAY (Default)
- S=0 -> B1 -> CAM
  S=1 -> B2 -> BT-PCM (Default)
- (near DSW2) SEL=0 -> A -> CAM
  SEL=1 -> B -> DISPLAY (Default)
- CAM
- CAM/DISPLAY
- (in symbol DIP-SW-1x-CHS-01TB-SMD) ON
- (in symbol MIPI-SWITCH - FSA642UMX) MIPI / SWITCH
- (in symbol MUX-AN-4x2-1 - 74CBTLV3257BQ) 4x2:1 / MUX
- (in symbol MyFAEVuoto) Project; Page name; Board; Designer; Project Code; Customer; Internal Code; Code; Data; Rev.; Rev. changes; Sheet; /
- (in symbol N-P MOS-FDC6327C-2.7A/1.9A/20V) p; n
- (in symbol NMOS - DMN3053L-7 - 4A/30V) n

### Library data of the parts
C11 C12 C243-C245 = CS-C-0402-100n/16V: CHIP CAP.CER. 100nF 16V 10% X7R 0402; MPN: Generic; Alternative MPN: C0402C104K4RACTU; Room: DISPLAY DSI; Pkg Type: SMD; Mount: Yes
C61 = CS-C-0402-100n/16V: CHIP CAP.CER. 100nF 16V 10% X7R 0402; MPN: Generic; Alternative MPN: C0402C104K4RACTU; Room: CAMERA CSI; Pkg Type: SMD; Mount: Yes
DS1 = DIODO4x - BAV99BRVA-7 -0.2A/75V: Diode Switching 75V 0.215A 6-Pin SOT-563 T/R; Room: DISPLAY DSI; Note: 2x Serie; Pkg Type: SMD; Temperature range: -65°..+150°; MPN: BAV99BRVA-7; Mount: Yes
DS4 DS5 = DIODO4x - BAV99BRVA-7 -0.2A/75V: Diode Switching 75V 0.215A 6-Pin SOT-563 T/R; Room: CAMERA CSI; Note: 2x Serie; Pkg Type: SMD; Temperature range: -65°..+150°; MPN: BAV99BRVA-7; Mount: Yes
DSW2 = DIP-SW-1x-CHS-01TB-SMD: Dip Switch SPST 1 Position - Surface Mount Slide (Standard) - Actuator 100mA 6VDC; Pkg Type: SMD; Temperature range: -40°..+85°; MPN: CHS-01TB; Mount: Yes
J3 = FPC-ZIF - J-15X2-0100-FDS-ZIF: CONN FPC VERT 15POS 1.00MM SMD; Room: DISPLAY DSI; Temperature range: -20°..+85°; Pkg Type: SMD; MPN: 1-1734248-5; Mount: Yes
J10 = FPC-ZIF - J-15X2-0100-FDS-ZIF: CONN FPC VERT 15POS 1.00MM SMD; Room: CAMERA CSI; Temperature range: -20°..+85°; Pkg Type: SMD; MPN: 1-1734248-5; Mount: Yes
L2-L4 L11-L13 = LCFE080602G900TG: Common Mode Chokes / Filters 90ohms 25% 100A 2 Lines 0806; Note: ESD Protection Inside; Pkg Type: SMD; MPN: LCFE080602G900TG; Mount: Yes
Q20 = N-P MOS-FDC6327C-2.7A/1.9A/20V: MOSFET N/P-CH 20V SSOT-6; Pkg Type: SMD; Temperature range: -55°..+150°; MPN: FDC6327C; Mount: Yes
Q21 = NMOS - DMN3053L-7 - 4A/30V: MOSFET N-CH 30V 4A SOT23; Pkg Type: SMD; Temperature range: -55°..+150°; MPN: DMN3053L-7; Mount: Yes
R7 R10 = RS-0402-100k: as R18 on sheet 01 - CML3 CONNECTOR; Mount: Yes
R23-R26 = RS-0402-100r: CHIP RES. 100R 0402 1/16W 1%; MPN: Generic; Pkg Type: SMD; Room: DISPLAY DSI; Mount: Yes
R81-R88 = RS-0402-100r: CHIP RES. 100R 0402 1/16W 1%; MPN: Generic; Pkg Type: SMD; Room: CAMERA CSI; Mount: Yes
R309 = RS-0402-0r: CHIP RES. 0R 0402 1/16W 1%; MPN: Generic; Pkg Type: SMD; Mount: Yes
R316 R317 = RS-0402-2.2k: CHIP RES. 2K2 0402 1/16W 1%; MPN: Generic; Pkg Type: SMD; Mount: Yes
R318 R319 = RS-0402-2.49k: as R1 on sheet 01 - CML3 CONNECTOR; Mount: Yes
TVS2 = TVS-UNI6x - TPD6E001RSER: TVS DIODE 5VWM; Room: CAMERA CSI; Pkg Type: SMD; Note: Unidirectional - 6x - High-Speed Data Interface  I/O; Temperature range: -40°..+85°; MPN: TPD6E001RSER; Mount: Yes
U31 = MIPI-SWITCH - FSA642UMX: IC SWITCH 3PDT 24UMLP; Note: Up to 1GHz; Pkg Type: SMD; Temperature range: -40°..85°; MPN: FSA642UMX; Mount: Yes
U32 U33 = MUX-AN-4x2-1 - 74CBTLV3257BQ: IC MUX/DEMUX 4 X 1:2 16DHVQFN; Pkg Type: SMD; Temperature range: -40°..125°; MPN: 74CBTLV3257BQ; Mount: Yes
*#4 = MyFAEVuoto: Page Count: 11; Customer Code: -; Database: -